# Altium project SVPX_FMC_6U_SOM.PrjPcb (part 4 of 5)

## Sheet SoM.SchDoc
size A3
Used 2 times, as channels SoM, SoM. Parts and nets are listed once, with the designators drawn on the sheet.
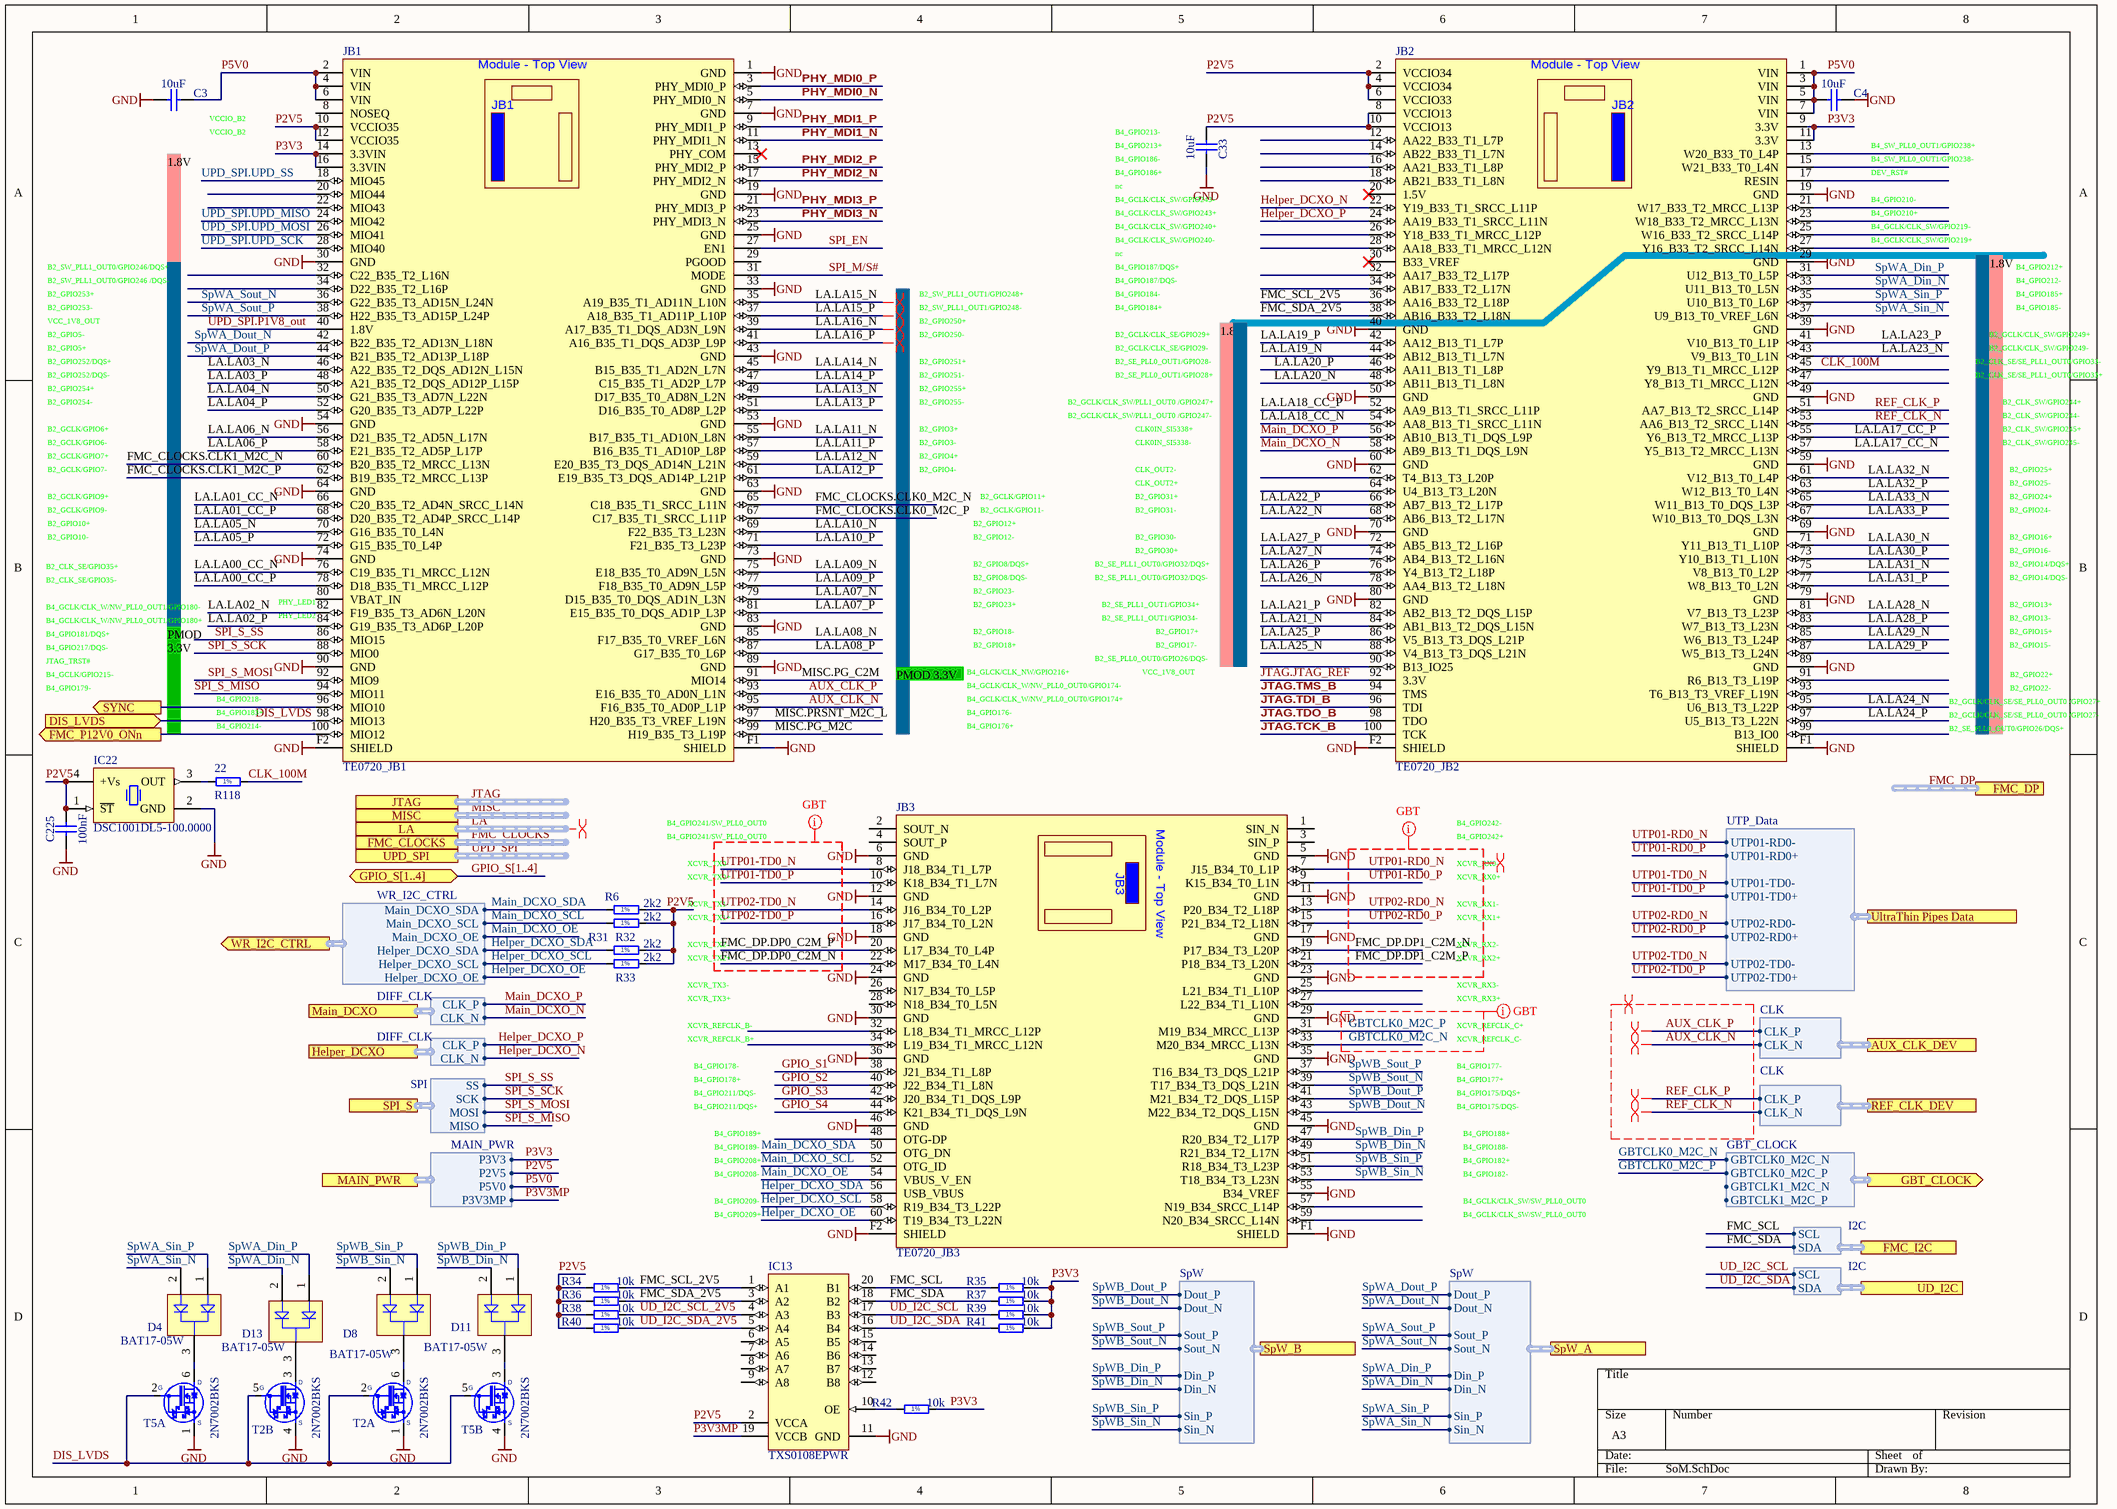
[diagram p11: SoM.SchDoc]

### Parts
C3  10uF  [CAPC2012X95N]
C4  10uF  [CAPC2012X95N]
C33  10uF  [CAPC2012X95N]
C225  100nF  [CAPC0603X33N]
D4  BAT17-05W  [INF-SOT323_N]
D8  BAT17-05W  [INF-SOT323_N]
D11  BAT17-05W  [INF-SOT323_N]
D13  BAT17-05W  [INF-SOT323_N]
IC13  TXS0108EPWR  [PW0020A_M]
IC22  DSC1001DL5-100.0000  [OSC_MICREL_2520]
JB1  TE0720_JB1  [LSHM-150-XXX-X-DV-A-X]
JB2  TE0720_JB2  [LSHM-150-XXX-X-DV-A-X]
JB3  TE0720_JB3  [LSHM-130-04.0-x-DV-A-S-K-TR]
R6  2k2  [RESC1005X40N]
R31  2k2  [RESC1005X40N]
R32  2k2  [RESC1005X40N]
R33  2k2  [RESC1005X40N]
R34  10k  [RESC1005X40N]
R35  10k  [RESC1005X40N]
R36  10k  [RESC1005X40N]
R37  10k  [RESC1005X40N]
R38  10k  [RESC1005X40N]
R39  10k  [RESC1005X40N]
R40  10k  [RESC1005X40N]
R41  10k  [RESC1005X40N]
R42  10k  [RESC1005X40N]
R118  22  [RESC1005X40N]
T2  2N7002BKS  [SOT65P210X110-6N]  (parts A,B of 2)
T5  2N7002BKS  [SOT65P210X110-6N]  (parts A,B of 2)

### Ports
AUX_CLK_DEV (harness CLK), DIS_LVDS (in), FMC_CLOCKS (harness FMC_CLOCKS), FMC_DP (harness FMC_DP), FMC_I2C (harness I2C), FMC_P12V0_ONn (out), GBT_CLOCK (out, harness GBT_CLOCK), GPIO_S[1..4] (bidir), Helper_DCXO (harness DIFF_CLK), JTAG (harness JTAG), LA (harness FMC_J1_LA), Main_DCXO (harness DIFF_CLK), MAIN_PWR (harness MAIN_PWR), MISC (harness MISC), REF_CLK_DEV (harness CLK), SPI_S (harness SPI), SpW_A (harness SpW), SpW_B (harness SpW), SYNC (out), UD_I2C (harness I2C), UltraThin Pipes Data (harness UTP_Data), UPD_SPI (harness UPD_SPI), WR_I2C_CTRL (out, harness WR_I2C_CTRL)

### Harnesses
SpW: Sout_P, Sout_N, Dout_P, Dout_N, Sin_P, Sin_N, Din_P, Din_N
UTP_Data: UTP02-RD0-, UTP02-RD0+, UTP02-TD0-, UTP02-TD0+, UTP01-RD0-, UTP01-RD0+, UTP01-TD0-, UTP01-TD0+
CLK: CLK_P, CLK_N
GBT_CLOCK: GBTCLK0_M2C_N, GBTCLK0_M2C_P, GBTCLK1_M2C_N, GBTCLK1_M2C_P
SPI: MISO, MOSI, SCK, SS
I2C: SCL, SDA
WR_I2C_CTRL: Helper_DCXO_OE, Helper_DCXO_SCL, Helper_DCXO_SDA, Main_DCXO_OE, Main_DCXO_SCL, Main_DCXO_SDA
DIFF_CLK: CLK_N, CLK_P
MAIN_PWR: P3V3, P2V5, P5V0, P3V3MP

### Nets
GND: C3.2 C4.1 C33.2 C225.1 IC13.11(GND) IC22.2(GND) JB1.1(GND) JB1.7(GND) JB1.19(GND) JB1.25(GND) JB1.30(GND) JB1.33(GND) JB1.43(GND) JB1.53(GND) JB1.54(GND) JB1.63(GND) JB1.64(GND) JB1.73(GND) JB1.74(GND) JB1.83(GND) JB1.89(GND) JB1.90(GND) JB1.F1(SHIELD) JB1.F2(SHIELD) JB2.19(GND) JB2.29(GND) JB2.39(GND) JB2.40(GND) JB2.49(GND) JB2.50(GND) JB2.59(GND) JB2.60(GND) JB2.69(GND) JB2.70(GND) JB2.79(GND) JB2.80(GND) JB2.89(GND) JB2.F1(SHIELD) JB2.F2(SHIELD) JB3.5(GND) JB3.6(GND) JB3.11(GND) JB3.12(GND) JB3.17(GND) JB3.18(GND) JB3.23(GND) JB3.24(GND) JB3.29(GND) JB3.30(GND) JB3.35(GND) JB3.36(GND) JB3.45(GND) JB3.46(GND) JB3.55(B34_VREF) JB3.F1(SHIELD) JB3.F2(SHIELD) T2.1(S) T2.4(S) T5.1(S) T5.4(S)
AUX_CLK_N: JB1.95(F16_B35_T0_AD0P_L1P) ; port AUX_CLK_DEV.CLK_N
AUX_CLK_P: JB1.93(E16_B35_T0_AD0N_L1N) ; port AUX_CLK_DEV.CLK_P
CLK_100M: JB2.45(Y9_B13_T1_MRCC_L12P) R118.2
DIS_LVDS: JB1.98(MIO13) T2.2(G) T2.5(G) T5.2(G) T5.5(G) ; port DIS_LVDS
FMC_CLOCKS.CLK0_M2C_N: JB1.65(C18_B35_T1_SRCC_L11N)
FMC_CLOCKS.CLK0_M2C_P: JB1.67(C17_B35_T1_SRCC_L11P)
FMC_CLOCKS.CLK1_M2C_N: JB1.60(B20_B35_T2_MRCC_L13N)
FMC_CLOCKS.CLK1_M2C_P: JB1.62(B19_B35_T2_MRCC_L13P)
FMC_DP.DP0_C2M_N: JB3.22(M17_B34_T0_L4N)
FMC_DP.DP0_C2M_P: JB3.20(L17_B34_T0_L4P)
FMC_DP.DP1_C2M_N: JB3.19(P17_B34_T3_L20P)
FMC_DP.DP1_C2M_P: JB3.21(P18_B34_T3_L20N)
FMC_P12V0_ONn: JB1.100(MIO12) ; port FMC_P12V0_ONn
FMC_SCL: IC13.20(B1) R35.1 ; port FMC_I2C.SCL
FMC_SCL_2V5: IC13.1(A1) JB2.36(AA16_B33_T2_L18P) R34.2
FMC_SDA: IC13.18(B2) R37.1 ; port FMC_I2C.SDA
FMC_SDA_2V5: IC13.3(A2) JB2.38(AB16_B33_T2_L18N) R36.2
GBTCLK0_M2C_N: JB3.33(M20_B34_MRCC_L13N) ; port GBT_CLOCK.GBTCLK0_M2C_N
GBTCLK0_M2C_P: JB3.31(M19_B34_MRCC_L13P) ; port GBT_CLOCK.GBTCLK0_M2C_P
GPIO_S1: JB3.38(J21_B34_T1_L8P)
GPIO_S2: JB3.40(J22_B34_T1_L8N)
GPIO_S3: JB3.42(J20_B34_T1_DQS_L9P)
GPIO_S4: JB3.44(K21_B34_T1_DQS_L9N)
Helper_DCXO_N: JB2.22(Y19_B33_T1_SRCC_L11P) ; port Helper_DCXO.CLK_N
Helper_DCXO_OE: JB3.60(T19_B34_T3_L22N) ; port WR_I2C_CTRL.Helper_DCXO_OE
Helper_DCXO_P: JB2.24(AA19_B33_T1_SRCC_L11N) ; port Helper_DCXO.CLK_P
Helper_DCXO_SCL: JB3.58(R19_B34_T3_L22P) R33.1 ; port WR_I2C_CTRL.Helper_DCXO_SCL
Helper_DCXO_SDA: JB3.56(USB_VBUS) R31.1 ; port WR_I2C_CTRL.Helper_DCXO_SDA
JTAG.JTAG_REF: JB2.92(3.3V)
JTAG.TCK_B: JB2.100(TCK)
JTAG.TDI_B: JB2.96(TDI)
JTAG.TDO_B: JB2.98(TDO)
JTAG.TMS_B: JB2.94(TMS)
LA.LA00_CC_N: JB1.76(C19_B35_T1_MRCC_L12N)
LA.LA00_CC_P: JB1.78(D18_B35_T1_MRCC_L12P)
LA.LA01_CC_N: JB1.66(C20_B35_T2_AD4N_SRCC_L14N)
LA.LA01_CC_P: JB1.68(D20_B35_T2_AD4P_SRCC_L14P)
LA.LA02_N: JB1.82(F19_B35_T3_AD6N_L20N)
LA.LA02_P: JB1.84(G19_B35_T3_AD6P_L20P)
LA.LA03_N: JB1.46(A22_B35_T2_DQS_AD12N_L15N)
LA.LA03_P: JB1.48(A21_B35_T2_DQS_AD12P_L15P)
LA.LA04_N: JB1.50(G21_B35_T3_AD7N_L22N)
LA.LA04_P: JB1.52(G20_B35_T3_AD7P_L22P)
LA.LA05_N: JB1.70(G16_B35_T0_L4N)
LA.LA05_P: JB1.72(G15_B35_T0_L4P)
LA.LA06_N: JB1.56(D21_B35_T2_AD5N_L17N)
LA.LA06_P: JB1.58(E21_B35_T2_AD5P_L17P)
LA.LA07_N: JB1.79(D15_B35_T0_DQS_AD1N_L3N)
LA.LA07_P: JB1.81(E15_B35_T0_DQS_AD1P_L3P)
LA.LA08_N: JB1.85(F17_B35_T0_VREF_L6N)
LA.LA08_P: JB1.87(G17_B35_T0_L6P)
LA.LA09_N: JB1.75(E18_B35_T0_AD9N_L5N)
LA.LA09_P: JB1.77(F18_B35_T0_AD9N_L5P)
LA.LA10_N: JB1.69(F22_B35_T3_L23N)
LA.LA10_P: JB1.71(F21_B35_T3_L23P)
LA.LA11_N: JB1.55(B17_B35_T1_AD10N_L8N)
LA.LA11_P: JB1.57(B16_B35_T1_AD10P_L8P)
LA.LA12_N: JB1.59(E20_B35_T3_DQS_AD14N_L21N)
LA.LA12_P: JB1.61(E19_B35_T3_DQS_AD14P_L21P)
LA.LA13_N: JB1.49(D17_B35_T0_AD8N_L2N)
LA.LA13_P: JB1.51(D16_B35_T0_AD8P_L2P)
LA.LA14_N: JB1.45(B15_B35_T1_AD2N_L7N)
LA.LA14_P: JB1.47(C15_B35_T1_AD2P_L7P)
LA.LA15_N: JB1.35(A19_B35_T1_AD11N_L10N)
LA.LA15_P: JB1.37(A18_B35_T1_AD11P_L10P)
LA.LA16_N: JB1.39(A17_B35_T1_DQS_AD3N_L9N)
LA.LA16_P: JB1.41(A16_B35_T1_DQS_AD3P_L9P)
LA.LA17_CC_N: JB2.57(Y5_B13_T2_MRCC_L13N)
LA.LA17_CC_P: JB2.55(Y6_B13_T2_MRCC_L13P)
LA.LA18_CC_N: JB2.54(AA8_B13_T1_SRCC_L11N)
LA.LA18_CC_P: JB2.52(AA9_B13_T1_SRCC_L11P)
LA.LA19_N: JB2.44(AB12_B13_T1_L7N)
LA.LA19_P: JB2.42(AA12_B13_T1_L7P)
LA.LA20_N: JB2.48(AB11_B13_T1_L8N)
LA.LA20_P: JB2.46(AA11_B13_T1_L8P)
LA.LA21_N: JB2.84(AB1_B13_T2_DQS_L15N)
LA.LA21_P: JB2.82(AB2_B13_T2_DQS_L15P)
LA.LA22_N: JB2.68(AB6_B13_T2_L17N)
LA.LA22_P: JB2.66(AB7_B13_T2_L17P)
LA.LA23_N: JB2.43(V9_B13_T0_L1N)
LA.LA23_P: JB2.41(V10_B13_T0_L1P)
LA.LA24_N: JB2.95(U6_B13_T3_L22P)
LA.LA24_P: JB2.97(U5_B13_T3_L22N)
LA.LA25_N: JB2.88(V4_B13_T3_DQS_L21N)
LA.LA25_P: JB2.86(V5_B13_T3_DQS_L21P)
LA.LA26_N: JB2.78(AA4_B13_T2_L18N)
LA.LA26_P: JB2.76(Y4_B13_T2_L18P)
LA.LA27_N: JB2.74(AB4_B13_T2_L16N)
LA.LA27_P: JB2.72(AB5_B13_T2_L16P)
LA.LA28_N: JB2.81(V7_B13_T3_L23P)
LA.LA28_P: JB2.83(W7_B13_T3_L23N)
LA.LA29_N: JB2.85(W6_B13_T3_L24P)
LA.LA29_P: JB2.87(W5_B13_T3_L24N)
LA.LA30_N: JB2.71(Y11_B13_T1_L10P)
LA.LA30_P: JB2.73(Y10_B13_T1_L10N)
LA.LA31_N: JB2.75(V8_B13_T0_L2P)
LA.LA31_P: JB2.77(W8_B13_T0_L2N)
LA.LA32_N: JB2.61(V12_B13_T0_L4P)
LA.LA32_P: JB2.63(W12_B13_T0_L4N)
LA.LA33_N: JB2.65(W11_B13_T0_DQS_L3P)
LA.LA33_P: JB2.67(W10_B13_T0_DQS_L3N)
Main_DCXO_N: JB2.58(AB9_B13_T1_DQS_L9N) ; port Main_DCXO.CLK_N
Main_DCXO_OE: JB3.54(VBUS_V_EN) ; port WR_I2C_CTRL.Main_DCXO_OE
Main_DCXO_P: JB2.56(AB10_B13_T1_DQS_L9P) ; port Main_DCXO.CLK_P
Main_DCXO_SCL: JB3.52(OTG_ID) R32.1 ; port WR_I2C_CTRL.Main_DCXO_SCL
Main_DCXO_SDA: JB3.50(OTG_DN) R6.1 ; port WR_I2C_CTRL.Main_DCXO_SDA
MISC.PG_C2M: JB1.91(MIO14)
MISC.PG_M2C: JB1.99(H19_B35_T3_L19P)
MISC.PRSNT_M2C_L: JB1.97(H20_B35_T3_VREF_L19N)
P2V5: C33.1 C225.2 IC13.2(VCCA) IC22.1(~{ST}) IC22.4(+Vs) JB1.10(VCCIO35) JB1.12(VCCIO35) JB2.2(VCCIO34) JB2.4(VCCIO34) JB2.6(VCCIO33) JB2.8(VCCIO13) JB2.10(VCCIO13) R6.2 R31.2 R32.2 R33.2 R34.1 R36.1 R38.1 R40.1 ; port MAIN_PWR.P2V5  [also labelled XCVR_TX1-]
P3V3: JB1.14(3.3VIN) JB1.16(3.3VIN) JB2.9(3.3V) JB2.11(3.3V) R35.2 R37.2 R39.2 R41.2 R42.2 ; port MAIN_PWR.P3V3
P3V3MP: IC13.19(VCCB) ; port MAIN_PWR.P3V3MP
P5V0: C3.1 C4.2 JB1.2(VIN) JB1.4(VIN) JB1.6(VIN) JB2.1(VIN) JB2.3(VIN) JB2.5(VIN) JB2.7(VIN) ; port MAIN_PWR.P5V0
PHY_MDI0_N: JB1.5(PHY_MDI0_N)
PHY_MDI0_P: JB1.3(PHY_MDI0_P)
PHY_MDI1_N: JB1.11(PHY_MDI1_N)
PHY_MDI1_P: JB1.9(PHY_MDI1_P)
PHY_MDI2_N: JB1.17(PHY_MDI2_N)
PHY_MDI2_P: JB1.15(PHY_MDI2_P)
PHY_MDI3_N: JB1.23(PHY_MDI3_N)
PHY_MDI3_P: JB1.21(PHY_MDI3_P)
REF_CLK_N: JB2.53(AA6_B13_T2_SRCC_L14N) ; port REF_CLK_DEV.CLK_N
REF_CLK_P: JB2.51(AA7_B13_T2_SRCC_L14P) ; port REF_CLK_DEV.CLK_P
SPI_EN: JB1.27(EN1)
SPI_M/S#: JB1.31(MODE)
SPI_S_MISO: JB1.94(MIO11) ; port SPI_S.MISO
SPI_S_MOSI: JB1.92(MIO9) ; port SPI_S.MOSI
SPI_S_SCK: JB1.88(MIO0) ; port SPI_S.SCK
SPI_S_SS: JB1.86(MIO15) ; port SPI_S.SS
SpWA_Din_N: D13.2(A2) JB2.33(U11_B13_T0_L5N) ; port SpW_A.Din_N
SpWA_Din_P: D13.1(A1) JB2.31(U12_B13_T0_L5P) ; port SpW_A.Din_P
SpWA_Dout_N: JB1.42(B22_B35_T2_AD13N_L18N) ; port SpW_A.Dout_N
SpWA_Dout_P: JB1.44(B21_B35_T2_AD13P_L18P) ; port SpW_A.Dout_P
SpWA_Sin_N: D4.2(A2) JB2.37(U9_B13_T0_VREF_L6N) ; port SpW_A.Sin_N
SpWA_Sin_P: D4.1(A1) JB2.35(U10_B13_T0_L6P) ; port SpW_A.Sin_P
SpWA_Sout_N: JB1.36(G22_B35_T3_AD15N_L24N) ; port SpW_A.Sout_N
SpWA_Sout_P: JB1.38(H22_B35_T3_AD15P_L24P) ; port SpW_A.Sout_P
SpWB_Din_N: D11.2(A2) JB3.49(R21_B34_T2_L17N) ; port SpW_B.Din_N
SpWB_Din_P: D11.1(A1) JB3.47(R20_B34_T2_L17P) ; port SpW_B.Din_P
SpWB_Dout_N: JB3.43(M22_B34_T2_DQS_L15N) ; port SpW_B.Dout_N
SpWB_Dout_P: JB3.41(M21_B34_T2_DQS_L15P) ; port SpW_B.Dout_P
SpWB_Sin_N: D8.2(A2) JB3.53(T18_B34_T3_L23N) ; port SpW_B.Sin_N
SpWB_Sin_P: D8.1(A1) JB3.51(R18_B34_T3_L23P) ; port SpW_B.Sin_P
SpWB_Sout_N: JB3.39(T17_B34_T3_DQS_L21N) ; port SpW_B.Sout_N
SpWB_Sout_P: JB3.37(T16_B34_T3_DQS_L21P) ; port SpW_B.Sout_P
SYNC: JB1.96(MIO10) ; port SYNC
UD_I2C_SCL: IC13.17(B3) R39.1 ; port UD_I2C.SCL
UD_I2C_SCL_2V5: IC13.4(A3) R38.2
UD_I2C_SDA: IC13.16(B4) R41.1 ; port UD_I2C.SDA
UD_I2C_SDA_2V5: IC13.5(A4) R40.2
UPD_SPI.P1V8_out: JB1.40(1.8V)
UPD_SPI.UPD_MISO: JB1.24(MIO42)
UPD_SPI.UPD_MOSI: JB1.26(MIO41)
UPD_SPI.UPD_SCK: JB1.28(MIO40)
UPD_SPI.UPD_SS: JB1.18(MIO45)
UTP01-RD0_N: JB3.7(J15_B34_T0_L1P) ; port UltraThin Pipes Data.UTP01-RD0-
UTP01-RD0_P: JB3.9(K15_B34_T0_L1N) ; port UltraThin Pipes Data.UTP01-RD0+
UTP01-TD0_N: JB3.8(J18_B34_T1_L7P) ; port UltraThin Pipes Data.UTP01-TD0-
UTP01-TD0_P: JB3.10(K18_B34_T1_L7N) ; port UltraThin Pipes Data.UTP01-TD0+
UTP02-RD0_N: JB3.13(P20_B34_T2_L18P) ; port UltraThin Pipes Data.UTP02-RD0-
UTP02-RD0_P: JB3.15(P21_B34_T2_L18N) ; port UltraThin Pipes Data.UTP02-RD0+
UTP02-TD0_N: JB3.14(J16_B34_T0_L2P) ; port UltraThin Pipes Data.UTP02-TD0-
UTP02-TD0_P: JB3.16(J17_B34_T0_L2N) ; port UltraThin Pipes Data.UTP02-TD0+
NetD4_3: D4.3(K) T5.6(D)
NetD8_3: D8.3(K) T2.6(D)
NetD11_3: D11.3(K) T5.3(D)
NetD13_3: D13.3(K) T2.3(D)
NetIC13_10: IC13.10(OE) R42.1
NetIC22_3: IC22.3(OUT) R118.1

Not connected (* = marked no-connect by the designer): IC13 6(A5) 7(A6) 8(A7) 9(A8) 12(B8) 13(B7) 14(B6) 15(B5); JB1 8(NOSEQ) 13(PHY_COM)* 20(MIO44) 22(MIO43) 29(PGOOD) 32(C22_B35_T2_L16N) 34(D22_B35_T2_L16P) 80(VBAT_IN); JB2 12(AA22_B33_T1_L7P) 13(W20_B33_T0_L4P) 14(AB22_B33_T1_L7N) 15(W21_B33_T0_L4N) 16(AA21_B33_T1_L8P) 17(RESIN) 18(AB21_B33_T1_L8N) 20(1.5V)* 21(W17_B33_T2_MRCC_L13P) 23(W18_B33_T2_MRCC_L13N) 25(W16_B33_T2_SRCC_L14P) 26(Y18_B33_T1_MRCC_L12P) 27(Y16_B33_T2_SRCC_L14N) 28(AA18_B33_T1_MRCC_L12N) 30(B33_VREF)* 32(AA17_B33_T2_L17P) 34(AB17_B33_T2_L17N) 47(Y8_B13_T1_MRCC_L12N) 62(T4_B13_T3_L20P) 64(U4_B13_T3_L20N) 90(B13_IO25) 91(R6_B13_T3_L19P) 93(T6_B13_T3_VREF_L19N) 99(B13_IO0); JB3 1(SIN_N) 2(SOUT_N) 3(SIN_P) 4(SOUT_P) 25(L21_B34_T1_L10P) 26(N17_B34_T0_L5P) 27(L22_B34_T1_L10N) 28(N18_B34_T0_L5N) 32(L18_B34_T1_MRCC_L12P) 34(L19_B34_T1_MRCC_L12N) 48(OTG-DP) 57(N19_B34_SRCC_L14P) 59(N20_B34_SRCC_L14N)

### Channels
SoM: designators end in A; ports DIS_LVDS=DIS_LVDS FMC_P12V0_ONn=FMC_P12V0_ONn SYNC=SYNC
SoM: designators end in B; ports DIS_LVDS=DIS_LVDS FMC_P12V0_ONn=FMC_P12V0_ONn SYNC=SYNC

### Buses and harness runs
bus GPIO_S[1..4] = port GPIO_S[1..4]
harness FMC_CLOCKS = port FMC_CLOCKS
harness FMC_DP = port FMC_DP
harness JTAG = port JTAG
harness LA = port LA
harness MISC = port MISC
harness UPD_SPI = port UPD_SPI

### Layout directives
differential pair: (no net found under the mark), AUX_CLK_N, AUX_CLK_N_SoM, AUX_CLK_P, AUX_CLK_P_SoM, FMC_DP.DP1_C2M_N, FMC_DP.DP1_C2M_P, LA.LA15_N_SoM, LA.LA15_P_SoM, LA.LA16_N_SoM, LA.LA16_P_SoM, REF_CLK_N, REF_CLK_N_SoM, REF_CLK_P, REF_CLK_P_SoM, UTP01-RD0_N, UTP01-RD0_P, UTP02-RD0_N, UTP02-RD0_P, XCVR_RX0+, XCVR_RX0-, XCVR_RX1+, XCVR_RX1-, XCVR_RX2+, XCVR_RX2-
net class GBT; rule Differential Pairs Routing [Pref Gap = 4.33mil    Min Gap  = 4.291mil    Max Gap  = 5milPref Width = 3.385mil    Min Width  = 3.385mil    Max Width  = 7.086mil]: FMC_DP.DP0_C2M_N, FMC_DP.DP0_C2M_P, FMC_DP.DP1_C2M_N, FMC_DP.DP1_C2M_P, GBTCLK0_M2C_N, GBTCLK0_M2C_P, UTP01-RD0_N, UTP01-RD0_P, UTP01-TD0_N, UTP01-TD0_P, UTP02-RD0_N, UTP02-RD0_P, UTP02-TD0_N, UTP02-TD0_P, XCVR_REFCLK_C+, XCVR_REFCLK_C-, XCVR_RX0+, XCVR_RX0-, XCVR_RX1+, XCVR_RX1-, XCVR_RX2+, XCVR_RX2-

### Notes on the sheet
- (near C3) VCCIO_B2
- (near C33) B4_GPIO213-
- (near C33) B4_GPIO213+
- (near C33) B4_GPIO186-
- B4_GPIO186+
- (near C4) B4_SW_PLL0_OUT1/GPIO238+
- B4_SW_PLL0_OUT1/GPIO238-
- DEV_RST#
- nc
- (near C33) B4_GCLK/CLK_SW/GPIO243-
- B4_GCLK/CLK_SW/GPIO243+
- B4_GCLK/CLK_SW/GPIO240+
- B4_GCLK/CLK_SW/GPIO240-
- B4_GPIO210-
- B4_GPIO210+
- B4_GCLK/CLK_SW/GPIO219-
- B4_GCLK/CLK_SW/GPIO219+
- B2_SW_PLL1_OUT0/GPIO246/DQS+
- B2_SW_PLL1_OUT0/GPIO246 /DQS-
- B2_GPIO253+
- B2_GPIO253-
- 1.8V
- B2_SW_PLL1_OUT1/GPIO248+
- B2_SW_PLL1_OUT1/GPIO248-
- B4_GPIO187/DQS+
- B4_GPIO187/DQS-
- B4_GPIO184-
- B4_GPIO184+
- B4_GPIO212+
- B4_GPIO212-
- B4_GPIO185+
- B4_GPIO185-
- VCC_1V8_OUT
- B2_GPIO5-
- B2_GPIO5+
- B2_GPIO252/DQS+
- B2_GPIO252/DQS-
- B2_GPIO250+
- B2_GPIO250-
- B2_GPIO251+
- B2_GPIO251-
- B2_GCLK/CLK_SE/GPIO29+
- B2_GCLK/CLK_SE/GPIO29-
- B2_SE_PLL0_OUT1/GPIO28-
- B2_SE_PLL0_OUT1/GPIO28+
- B2_CLK_SE/SE_PLL1_OUT0/GPIO33-
- B2_CLK_SE/SE_PLL1_OUT0/GPIO33+
- B2_GCLK/CLK_SW/GPIO249+
- B2_GCLK/CLK_SW/GPIO249-
- B2_GPIO254+
- B2_GPIO254-
- B2_GCLK/GPIO6+
- B2_GCLK/GPIO6-
- B2_GPIO255+
- B2_GPIO255-
- B2_GPIO3+
- B2_GPIO3-
- B2_GCLK/CLK_SW/PLL1_OUT0	/GPIO247+
- B2_GCLK/CLK_SW/PLL1_OUT0	/GPIO247-
- CLK0IN_SI5338+
- CLK0IN_SI5338-
- B2_CLK_SW/GPIO244+
- B2_CLK_SW/GPIO244-
- B2_CLK_SW/GPIO245+
- B2_CLK_SW/GPIO245-
- B2_GCLK/GPIO7+
- B2_GCLK/GPIO7-
- B2_GCLK/GPIO9+
- B2_GCLK/GPIO9-
- B2_GPIO4+
- B2_GPIO4-
- B2_GCLK/GPIO11+
- B2_GCLK/GPIO11-
- CLK_OUT2-
- CLK_OUT2+
- B2_GPIO31+
- B2_GPIO31-
- B2_GPIO25+
- B2_GPIO25-
- B2_GPIO24+
- B2_GPIO24-
- B2_CLK_SE/GPIO35+
- B2_CLK_SE/GPIO35-
- B2_GPIO10+
- B2_GPIO10-
- B2_GPIO12+
- B2_GPIO12-
- B2_GPIO8/DQS+
- B2_GPIO8/DQS-
- B2_SE_PLL1_OUT0/GPIO32/DQS+
- B2_SE_PLL1_OUT0/GPIO32/DQS-
- B2_GPIO30-
- B2_GPIO30+
- B2_GPIO16+
- B2_GPIO16-
- B2_GPIO14/DQS+
- B2_GPIO14/DQS-
- B4_GCLK/CLK_W/NW_PLL0_OUT1/GPIO180-
- B4_GCLK/CLK_W/NW_PLL0_OUT1/GPIO180+
- B4_GPIO181/DQS+
- B4_GPIO217/DQS-
- (near JB1) PHY_LED1
- (near JB1) PHY_LED2
- B2_GPIO23-
- B2_GPIO23+
- B2_GPIO18-
- B2_GPIO18+
- B2_SE_PLL1_OUT1/GPIO34+
- B2_SE_PLL1_OUT1/GPIO34-
- B2_GPIO17+
- B2_GPIO17-
- B2_GPIO13+
- B2_GPIO13-
- B2_GPIO15+
- B2_GPIO15-
- JTAG_TRST#
- B4_GCLK/GPIO215-
- B4_GPIO179-
- B4_GPIO218-
- B4_GPIO183+
- PMOD 3.3V
- B4_GLCK/CLK_NW/GPIO216+
- B4_GCLK/CLK_W/NW_PLL0_OUT0/GPIO174-
- B4_GCLK/CLK_W/NW_PLL0_OUT0/GPIO174+
- B4_GPIO176-
- B2_SE_PLL0_OUT0/GPIO26/DQS-
- B2_GCLK/CLK_SE/SE_PLL0_OUT0	/GPIO27+
- B2_GCLK/CLK_SE/SE_PLL0_OUT0	/GPIO27-
- B2_GPIO22+
- B2_GPIO22-
- B4_GPIO214-
- B4_GPIO176+
- B2_SE_PLL0_OUT0/GPIO26/DQS+
- B4_GCLK/CLK_SW/SW_PLL0_OUT0
- Labels drawn without touching a wire or pin: B4_GCLK/CLK_SW/SW_PLL0_OUT0, B4_GPIO175/DQS+, B4_GPIO175/DQS-, B4_GPIO177+, B4_GPIO177-, B4_GPIO178+, B4_GPIO178-, B4_GPIO182+, B4_GPIO182-, B4_GPIO188+, B4_GPIO188-, B4_GPIO189+, B4_GPIO189-, B4_GPIO208+, B4_GPIO208-, B4_GPIO209+, B4_GPIO209-, B4_GPIO211/DQS+, B4_GPIO211/DQS-, B4_GPIO241/SW_PLL0_OUT0, B4_GPIO242+, B4_GPIO242-, XCVR_REFCLK_B+, XCVR_REFCLK_B-, XCVR_REFCLK_C+, XCVR_REFCLK_C-, XCVR_RX0+, XCVR_RX0-, XCVR_RX1+, XCVR_RX1-, XCVR_RX2+, XCVR_RX2-, XCVR_RX3+, XCVR_RX3-, XCVR_TX0+, XCVR_TX0-, XCVR_TX1+, XCVR_TX2+, XCVR_TX2-, XCVR_TX3+, XCVR_TX3-
- (in symbol 25285) Module - Top View
- (in symbol 25286) Module - Top View
- (in symbol 25287) Module - Top View
- (in symbol R0402_2K2_1%_0.0625W_100PPM) 1%
- (in symbol R0402_10k_1%_0.0625W_100PPM) 1%
- (in symbol R0402_22R_1%_0.0625W_100PPM) 1%

### Library data of the parts
C3 C4 C33 = CC0805_10UF_25V_10%_X5R: Non-polarised capacitor; Part Description: SMD Multilayer Chip Ceramic Capacitor; Manufacturer: GENERIC; Manufacturer1 Part Number: GRM219R61E106KA12D; Voltage: 25V; TC: X5R; Tolerance: ±10%; Part Number: CC0805_10UF_25V_10%_X5R; Component Kind: Standard; Component Type: Standard; Pin Count: 2; Value: 10uF; Status: Preferred; Manufacturer Part Number: CC0805_10UF_25V_10%_X5R; Case: 0805; Mounted: Yes; Socket: No; SMD: Yes; Sense: No; Manufacturer1 Example: MURATA; Manufacturer1 ComponentHeight: 0.95mm; HelpURL: \\cern.ch\dfs\Applications\Altium\Datasheets\CC0805_X5R_MURATA_GRM.pdf; Author: CERN DEM JLC; CreateDate: 25/10/2012; LatestRevisionDate: 06/09/2016
C225 = CC0201_100NF_6.3V_10%_X5R: Non-polarised capacitor; Manufacturer: GENERIC; Part Description: SMD Multilayer Chip Ceramic Capacitor; Manufacturer1 Part Number: 02016D104KAT2A; Voltage: 6.3V; TC: X5R; Tolerance: ±10%; Part Number: CC0201_100NF_6.3V_10%_X5R; Component Kind: Standard; Component Type: Standard; Pin Count: 2; Value: 100nF; Status: Not Recommended; Manufacturer Part Number: CC0201_100NF_6.3V_10%_X5R; Case: 0201; Mounted: Yes; Socket: No; SMD: Yes; Sense: No; Manufacturer1 Example: AVX; Manufacturer1 ComponentHeight: 0.33mm; HelpURL: \\cern.ch\dfs\Applications\Altium\Datasheets\CC0201_X5R_AVX.pdf; Author: CERN DEM JLC; CreateDate: 03/12/2007; LatestRevisionDate: 03/12/2007
D4 D8 D11 D13 = CMP-1154-00018-1: Dual Silicon Schottky Diode, 130 mA IF Max, SOT323, Green; Manufacturer: Infineon; VF (typ): 0.34 V; CT (typ): 0.55 pF; Green: yes; Group: RF Mixer; IF (max): 130 mA; VR (max): 4 V; ComponentLink1URL: http://www.infineon.com/; Mounting Technology: Surface Mount; Halogen-free: yes; DatasheetVersion: Jun-2011; ComponentLink3Description: Package Specification; ComponentLink2URL: http://www.infineon.com/dgdl/bat17series.pdf?folderId=db3a304314dca3890114ff6812070b44&fileId=db3a304314dca389011517d785d60d4e&location=en.Products.RF.RF_Mixer___Detector_Schottky_Diodes.DATASHEET.bat17series.pdf; PartNumber: BAT17-05W; ComponentLink3URL: http://www.infineon.com/dgdl/SOT323-Package_Overview.pdf?folderId=db3a30431936bc4b0119533e1dcb3c92&fileId=db3a30431936bc4b011953495f283cb1; Configuration: Dual; PackageDescription: 3-Pin Small Outline Transistor Package, 1.25 x 2 mm Body, 0.65 mm Pitch; ComponentLink1Description: Manufacturer URL; ComponentLink2Description: Datasheet; PackageReference: SOT323
IC13 = CMP-2000-04956-1: Bidirectional Voltage-Level Translator for Open-Drain and Push-Pull Application, 8 bit, 1.2 to 3.6 V, -40 to 85 degC, 20-Pin TSSOP, Green (RoHS & no Sb/Br), Tape and Reel; Manufacturer: Texas Instruments; Logic Type: VoltageLevelTranslator; Output Current: 620µA; Propagation Delay: 4.8ns; Supply Voltage Min: 1.2V; No. of Inputs: 8; Supply Voltage Max: 5.5V; SVHC: NoSVHC(16-Jun-2014); No. of Pins: 20; Datasheet URL: https://datasheet.ciiva.com/14287/txs0108e-14287280.pdf; Operating Temperature Min: -40degC; Logic Case Style: TSSOP; Packaging: CutTape; Datasheet Version: Rev. B, 09/2008; MSL: MSL1-Unlimited; Manufacturer URL: http://www.ti.com/; Operating Temperature Max: 85degC
IC22 = OSC_DSC1001DL5-100.0000: MEMS 100MHz oscillator; Manufacturer: Micrel; Part Description: MEMS Oscillator 100MHz; Bonding: No; PressFit: No; Case: *; Component Kind: Standard; Component Type: Standard; ComponentHeigth: *; CreateDate: 2018-01-01; Device: DSC1001DL5-100.0000; Footprint: *; HelpURL: *; LatestRevisionDate: 2018-01-01; Manufacturer Part Number: DSC1001DL5-100.0000; Mounted: Yes; PackageDescription: MICREL SMD Oscillator, QFN, 4 pins, 2.5mm x 2.0mm; Part Number: DSC1001DL5-100.0000; Pin Count: 4; Sense: No; SMD: Yes; Socket: No; Value: *
JB1 = 25285: TE0720-JB1; AN: 25285; Mixed: SMT; Trenz-Stock: Yes; Trenz-Article-Number: 23838
JB2 = 25286: TE0720-JB2; AN: 25286; Mixed: SMT; Trenz-Stock: Yes; Trenz-Article-Number: 23838
JB3 = 25287: TE0720-JB3; AN: 25287; Mixed: SMT; Trenz-Stock: Yes; Trenz-Article-Number: 24903
R6 R31-R33 = R0402_2K2_1%_0.0625W_100PPM: Resistor - 1%; Part Description: General Purpose Thick Film Chip Resistor; Manufacturer: GENERIC; Manufacturer1 Part Number: 232270672202L; TC: ±100ppm/°C; PressFit: No; Part Number: R0402_2K2_1%_0.0625W_100PPM; Component Kind: Standard; Component Type: Standard; Pin Count: 2; Value: 2k2; Status: Not Recommended; Power: 0.0625W; Tolerance: ±1%; Manufacturer Part Number: R0402_2K2_1%_0.0625W_100PPM; Case: 0402; Mounted: Yes; Sense: No; Socket: No; SMD: Yes; Manufacturer1 Example: YAGEO PHYCOMP; Manufacturer1 ComponentHeight: 0.4mm; HelpURL: \\cern.ch\dfs\Applications\Altium\Datasheets\R0402_Phycomp_RC0402.pdf; Author: CERN DEM JLC; CreateDate: 03.12.2007; LatestRevisionDate: 17.10.2012
R34-R42 = R0402_10k_1%_0.0625W_100PPM: Resistor - 1%; Part Description: General Purpose Thick Film Chip Resistor; Manufacturer: GENERIC; Manufacturer1 Part Number: 232270671003L; TC: ±100ppm/°C; PressFit: No; Part Number: R0402_10K_1%_0.0625W_100PPM; Component Kind: Standard; Component Type: Standard; Pin Count: 2; Value: 10k; Status: Not Recommended; Power: 0.0625W; Tolerance: ±1%; Manufacturer Part Number: R0402_10K_1%_0.0625W_100PPM; Case: 0402; Mounted: Yes; Sense: No; Socket: No; SMD: Yes; Manufacturer1 Example: YAGEO PHYCOMP; Manufacturer1 ComponentHeight: 0.4mm; HelpURL: \\cern.ch\dfs\Applications\Altium\Datasheets\R0402_Phycomp_RC0402.pdf; Author: CERN DEM JLC; CreateDate: 03.12.2007; LatestRevisionDate: 17.10.2012
R118 = R0402_22R_1%_0.0625W_100PPM: Resistor - 1%; Part Description: General Purpose Thick Film Chip Resistor; Manufacturer: GENERIC; Manufacturer1 Part Number: 232270672209L; TC: ±100ppm/°C; PressFit: No; Part Number: R0402_22R_1%_0.0625W_100PPM; Component Kind: Standard; Component Type: Standard; Pin Count: 2; Value: 22; Status: Not Recommended; Power: 0.0625W; Tolerance: ±1%; Manufacturer Part Number: R0402_22R_1%_0.0625W_100PPM; Case: 0402; Mounted: Yes; Sense: No; Socket: No; SMD: Yes; Manufacturer1 Example: YAGEO PHYCOMP; Manufacturer1 ComponentHeight: 0.4mm; HelpURL: \\cern.ch\dfs\Applications\Altium\Datasheets\R0402_Phycomp_RC0402.pdf; Author: CERN DEM JLC; CreateDate: 03/12/2007; LatestRevisionDate: 17/10/2012
T2 T5 = 2N7002BKS: 60V, 300mA Dual N-Channel Trench MOSFET; Manufacturer: NXP SEMICONDUCTORS; Manufacturer Part Number: 2N7002BKS6; PressFit: No; Bonding: No; Part Number: 2N7002BKS; Component Kind: Standard; Component Type: Standard; Device: 2N7002BKS; PackageDescription: SOT363, SC70-6, SOT, 0.65mm Pitch, 6 pin, 1.25mm W X 2.00mm L X 1.10mm H, IPC Medium Density; Part Description: 60 V, 300 mA Dual N-Channel Trench MOSFET; Pin Count: 4; Case: SOT363; Mounted: Yes; Socket: No; SMD: Yes; Sense: No; ComponentHeight: 1.1mm; HelpURL: \\cern.ch\dfs\Applications\Altium\Datasheets\2N7002BKS.pdf; Author: CERN DEM JLC; CreateDate: 2012-11-27; LatestRevisionDate: 2012-11-27

## Sheet SLT3-PAY-1Q2T_P3.SchDoc
size A4
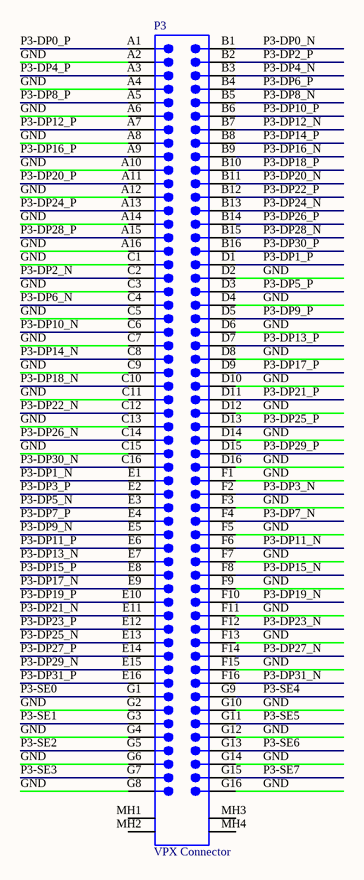
[diagram p12: SLT3-PAY-1Q2T_P3.SchDoc]

### Parts
P3  VPX Connector  [BTB1-8-4H112M]

### Nets
GND: P3.A2 P3.A4 P3.A6 P3.A8 P3.A10 P3.A12 P3.A14 P3.A16 P3.C1 P3.C3 P3.C5 P3.C7 P3.C9 P3.C11 P3.C13 P3.C15 P3.D2 P3.D4 P3.D6 P3.D8 P3.D10 P3.D12 P3.D14 P3.D16 P3.F1 P3.F3 P3.F5 P3.F7 P3.F9 P3.F11 P3.F13 P3.F15 P3.G2 P3.G4 P3.G6 P3.G8 P3.G10 P3.G12 P3.G14 P3.G16
P3-DP0_N: P3.B1
P3-DP0_P: P3.A1
P3-DP1_N: P3.E1
P3-DP1_P: P3.D1
P3-DP2_N: P3.C2
P3-DP2_P: P3.B2
P3-DP3_N: P3.F2
P3-DP3_P: P3.E2
P3-DP4_N: P3.B3
P3-DP4_P: P3.A3
P3-DP5_N: P3.E3
P3-DP5_P: P3.D3
P3-DP6_N: P3.C4
P3-DP6_P: P3.B4
P3-DP7_N: P3.F4
P3-DP7_P: P3.E4
P3-DP8_N: P3.B5
P3-DP8_P: P3.A5
P3-DP9_N: P3.E5
P3-DP9_P: P3.D5
P3-DP10_N: P3.C6
P3-DP10_P: P3.B6
P3-DP11_N: P3.F6
P3-DP11_P: P3.E6
P3-DP12_N: P3.B7
P3-DP12_P: P3.A7
P3-DP13_N: P3.E7
P3-DP13_P: P3.D7
P3-DP14_N: P3.C8
P3-DP14_P: P3.B8
P3-DP15_N: P3.F8
P3-DP15_P: P3.E8
P3-DP16_N: P3.B9
P3-DP16_P: P3.A9
P3-DP17_N: P3.E9
P3-DP17_P: P3.D9
P3-DP18_N: P3.C10
P3-DP18_P: P3.B10
P3-DP19_N: P3.F10
P3-DP19_P: P3.E10
P3-DP20_N: P3.B11
P3-DP20_P: P3.A11
P3-DP21_N: P3.E11
P3-DP21_P: P3.D11
P3-DP22_N: P3.C12
P3-DP22_P: P3.B12
P3-DP23_N: P3.F12
P3-DP23_P: P3.E12
P3-DP24_N: P3.B13
P3-DP24_P: P3.A13
P3-DP25_N: P3.E13
P3-DP25_P: P3.D13
P3-DP26_N: P3.C14
P3-DP26_P: P3.B14
P3-DP27_N: P3.F14
P3-DP27_P: P3.E14
P3-DP28_N: P3.B15
P3-DP28_P: P3.A15
P3-DP29_N: P3.E15
P3-DP29_P: P3.D15
P3-DP30_N: P3.C16
P3-DP30_P: P3.B16
P3-DP31_N: P3.F16
P3-DP31_P: P3.E16
P3-SE0: P3.G1
P3-SE1: P3.G3
P3-SE2: P3.G5
P3-SE3: P3.G7
P3-SE4: P3.G9
P3-SE5: P3.G11
P3-SE6: P3.G13
P3-SE7: P3.G15

Not connected (* = marked no-connect by the designer): P3 MH1 MH2 MH3 MH4

### Library data of the parts
P3 = 2102771-1: Ruggedized Board-to-Board Connector, Right Angle, 7-Row, Pitch 1.8mm, 112-Position; Manufacturer: TE; Bonding: No; ComponentHeigth: 14.7mm; PressFit: No; Case: *; Component Kind: Standard; Component Type: Standard; CreateDate: 2018-01-01; Device: *; Footprint: *; HelpURL: *; LatestRevisionDate: 2018-01-01; Manufacturer Part Number: 2102771-1; Mounted: Yes; PackageDescription: 2102771-1; Part Description: Ruggedized Board-to-Board Connector, Right Angle, 7-Row, Pitch 1.8mm, 112-Position; Part Number: 2102771-1; Pin Count: *; Sense: No; SMD: Yes; Socket: No; Family: VPX Connector

## Sheet SLT3-PAY-1Q2T_P4.SchDoc
size A4
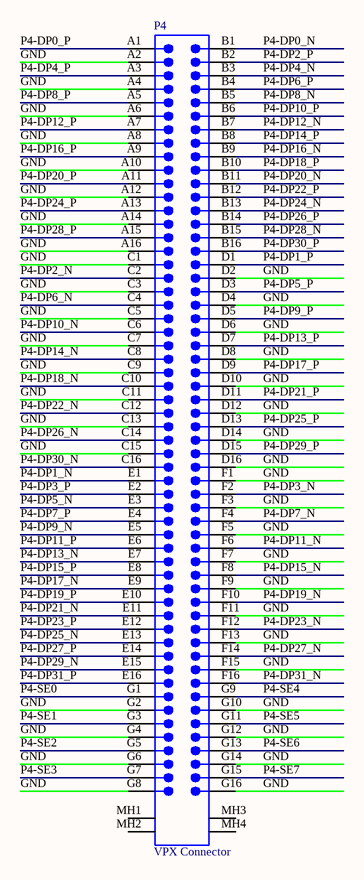
[diagram p13: SLT3-PAY-1Q2T_P4.SchDoc]

### Parts
P4  VPX Connector  [BTB1-8-4H112M]

### Nets
GND: P4.A2 P4.A4 P4.A6 P4.A8 P4.A10 P4.A12 P4.A14 P4.A16 P4.C1 P4.C3 P4.C5 P4.C7 P4.C9 P4.C11 P4.C13 P4.C15 P4.D2 P4.D4 P4.D6 P4.D8 P4.D10 P4.D12 P4.D14 P4.D16 P4.F1 P4.F3 P4.F5 P4.F7 P4.F9 P4.F11 P4.F13 P4.F15 P4.G2 P4.G4 P4.G6 P4.G8 P4.G10 P4.G12 P4.G14 P4.G16
P4-DP0_N: P4.B1
P4-DP0_P: P4.A1
P4-DP1_N: P4.E1
P4-DP1_P: P4.D1
P4-DP2_N: P4.C2
P4-DP2_P: P4.B2
P4-DP3_N: P4.F2
P4-DP3_P: P4.E2
P4-DP4_N: P4.B3
P4-DP4_P: P4.A3
P4-DP5_N: P4.E3
P4-DP5_P: P4.D3
P4-DP6_N: P4.C4
P4-DP6_P: P4.B4
P4-DP7_N: P4.F4
P4-DP7_P: P4.E4
P4-DP8_N: P4.B5
P4-DP8_P: P4.A5
P4-DP9_N: P4.E5
P4-DP9_P: P4.D5
P4-DP10_N: P4.C6
P4-DP10_P: P4.B6
P4-DP11_N: P4.F6
P4-DP11_P: P4.E6
P4-DP12_N: P4.B7
P4-DP12_P: P4.A7
P4-DP13_N: P4.E7
P4-DP13_P: P4.D7
P4-DP14_N: P4.C8
P4-DP14_P: P4.B8
P4-DP15_N: P4.F8
P4-DP15_P: P4.E8
P4-DP16_N: P4.B9
P4-DP16_P: P4.A9
P4-DP17_N: P4.E9
P4-DP17_P: P4.D9
P4-DP18_N: P4.C10
P4-DP18_P: P4.B10
P4-DP19_N: P4.F10
P4-DP19_P: P4.E10
P4-DP20_N: P4.B11
P4-DP20_P: P4.A11
P4-DP21_N: P4.E11
P4-DP21_P: P4.D11
P4-DP22_N: P4.C12
P4-DP22_P: P4.B12
P4-DP23_N: P4.F12
P4-DP23_P: P4.E12
P4-DP24_N: P4.B13
P4-DP24_P: P4.A13
P4-DP25_N: P4.E13
P4-DP25_P: P4.D13
P4-DP26_N: P4.C14
P4-DP26_P: P4.B14
P4-DP27_N: P4.F14
P4-DP27_P: P4.E14
P4-DP28_N: P4.B15
P4-DP28_P: P4.A15
P4-DP29_N: P4.E15
P4-DP29_P: P4.D15
P4-DP30_N: P4.C16
P4-DP30_P: P4.B16
P4-DP31_N: P4.F16
P4-DP31_P: P4.E16
P4-SE0: P4.G1
P4-SE1: P4.G3
P4-SE2: P4.G5
P4-SE3: P4.G7
P4-SE4: P4.G9
P4-SE5: P4.G11
P4-SE6: P4.G13
P4-SE7: P4.G15

Not connected (* = marked no-connect by the designer): P4 MH1 MH2 MH3 MH4

### Library data of the parts
P4 = 2102771-1: as P3 on sheet SLT3-PAY-1Q2T_P3; Case: *; Component Kind: Standard; Component Type: Standard; CreateDate: 2018-01-01; Device: *; Footprint: *; HelpURL: *; LatestRevisionDate: 2018-01-01; Manufacturer Part Number: 2102771-1; Mounted: Yes; PackageDescription: 2102771-1; Part Description: Ruggedized Board-to-Board Connector, Right Angle, 7-Row, Pitch 1.8mm, 112-Position; Part Number: 2102771-1; Pin Count: *; Sense: No; SMD: Yes; Socket: No; Family: VPX Connector

## Sheet SLT3-PAY-1Q2T_P6.SchDoc
size A4
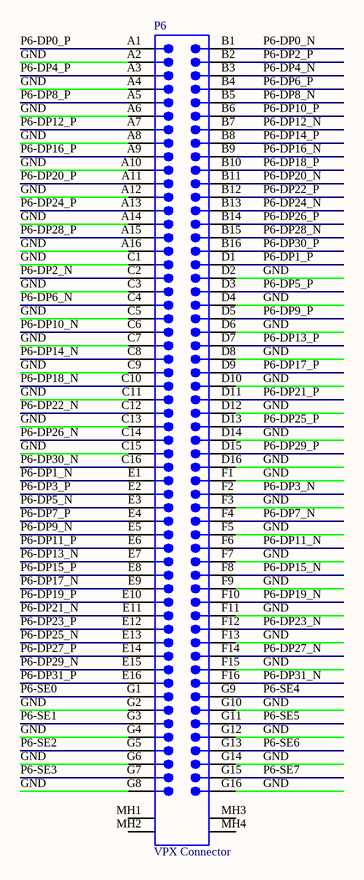
[diagram p14: SLT3-PAY-1Q2T_P6.SchDoc]

### Parts
P6  VPX Connector  [BTB1-8-4H112M]

### Nets
GND: P6.A2 P6.A4 P6.A6 P6.A8 P6.A10 P6.A12 P6.A14 P6.A16 P6.C1 P6.C3 P6.C5 P6.C7 P6.C9 P6.C11 P6.C13 P6.C15 P6.D2 P6.D4 P6.D6 P6.D8 P6.D10 P6.D12 P6.D14 P6.D16 P6.F1 P6.F3 P6.F5 P6.F7 P6.F9 P6.F11 P6.F13 P6.F15 P6.G2 P6.G4 P6.G6 P6.G8 P6.G10 P6.G12 P6.G14 P6.G16
P6-DP0_N: P6.B1
P6-DP0_P: P6.A1
P6-DP1_N: P6.E1
P6-DP1_P: P6.D1
P6-DP2_N: P6.C2
P6-DP2_P: P6.B2
P6-DP3_N: P6.F2
P6-DP3_P: P6.E2
P6-DP4_N: P6.B3
P6-DP4_P: P6.A3
P6-DP5_N: P6.E3
P6-DP5_P: P6.D3
P6-DP6_N: P6.C4
P6-DP6_P: P6.B4
P6-DP7_N: P6.F4
P6-DP7_P: P6.E4
P6-DP8_N: P6.B5
P6-DP8_P: P6.A5
P6-DP9_N: P6.E5
P6-DP9_P: P6.D5
P6-DP10_N: P6.C6
P6-DP10_P: P6.B6
P6-DP11_N: P6.F6
P6-DP11_P: P6.E6
P6-DP12_N: P6.B7
P6-DP12_P: P6.A7
P6-DP13_N: P6.E7
P6-DP13_P: P6.D7
P6-DP14_N: P6.C8
P6-DP14_P: P6.B8
P6-DP15_N: P6.F8
P6-DP15_P: P6.E8
P6-DP16_N: P6.B9
P6-DP16_P: P6.A9
P6-DP17_N: P6.E9
P6-DP17_P: P6.D9
P6-DP18_N: P6.C10
P6-DP18_P: P6.B10
P6-DP19_N: P6.F10
P6-DP19_P: P6.E10
P6-DP20_N: P6.B11
P6-DP20_P: P6.A11
P6-DP21_N: P6.E11
P6-DP21_P: P6.D11
P6-DP22_N: P6.C12
P6-DP22_P: P6.B12
P6-DP23_N: P6.F12
P6-DP23_P: P6.E12
P6-DP24_N: P6.B13
P6-DP24_P: P6.A13
P6-DP25_N: P6.E13
P6-DP25_P: P6.D13
P6-DP26_N: P6.C14
P6-DP26_P: P6.B14
P6-DP27_N: P6.F14
P6-DP27_P: P6.E14
P6-DP28_N: P6.B15
P6-DP28_P: P6.A15
P6-DP29_N: P6.E15
P6-DP29_P: P6.D15
P6-DP30_N: P6.C16
P6-DP30_P: P6.B16
P6-DP31_N: P6.F16
P6-DP31_P: P6.E16
P6-SE0: P6.G1
P6-SE1: P6.G3
P6-SE2: P6.G5
P6-SE3: P6.G7
P6-SE4: P6.G9
P6-SE5: P6.G11
P6-SE6: P6.G13
P6-SE7: P6.G15

Not connected (* = marked no-connect by the designer): P6 MH1 MH2 MH3 MH4

### Library data of the parts
P6 = 2102771-1: as P3 on sheet SLT3-PAY-1Q2T_P3; Case: *; Component Kind: Standard; Component Type: Standard; CreateDate: 2018-01-01; Device: *; Footprint: *; HelpURL: *; LatestRevisionDate: 2018-01-01; Manufacturer Part Number: 2102771-1; Mounted: Yes; PackageDescription: 2102771-1; Part Description: Ruggedized Board-to-Board Connector, Right Angle, 7-Row, Pitch 1.8mm, 112-Position; Part Number: 2102771-1; Pin Count: *; Sense: No; SMD: Yes; Socket: No; Family: VPX Connector

## Sheet SLT3-PAY-1Q2T_P5.SchDoc
size A4
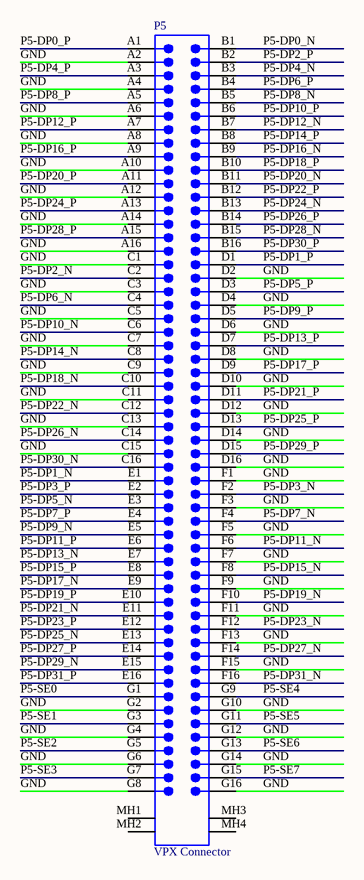
[diagram p15: SLT3-PAY-1Q2T_P5.SchDoc]

### Parts
P5  VPX Connector  [BTB1-8-4H112M]

### Nets
GND: P5.A2 P5.A4 P5.A6 P5.A8 P5.A10 P5.A12 P5.A14 P5.A16 P5.C1 P5.C3 P5.C5 P5.C7 P5.C9 P5.C11 P5.C13 P5.C15 P5.D2 P5.D4 P5.D6 P5.D8 P5.D10 P5.D12 P5.D14 P5.D16 P5.F1 P5.F3 P5.F5 P5.F7 P5.F9 P5.F11 P5.F13 P5.F15 P5.G2 P5.G4 P5.G6 P5.G8 P5.G10 P5.G12 P5.G14 P5.G16
P5-DP0_N: P5.B1
P5-DP0_P: P5.A1
P5-DP1_N: P5.E1
P5-DP1_P: P5.D1
P5-DP2_N: P5.C2
P5-DP2_P: P5.B2
P5-DP3_N: P5.F2
P5-DP3_P: P5.E2
P5-DP4_N: P5.B3
P5-DP4_P: P5.A3
P5-DP5_N: P5.E3
P5-DP5_P: P5.D3
P5-DP6_N: P5.C4
P5-DP6_P: P5.B4
P5-DP7_N: P5.F4
P5-DP7_P: P5.E4
P5-DP8_N: P5.B5
P5-DP8_P: P5.A5
P5-DP9_N: P5.E5
P5-DP9_P: P5.D5
P5-DP10_N: P5.C6
P5-DP10_P: P5.B6
P5-DP11_N: P5.F6
P5-DP11_P: P5.E6
P5-DP12_N: P5.B7
P5-DP12_P: P5.A7
P5-DP13_N: P5.E7
P5-DP13_P: P5.D7
P5-DP14_N: P5.C8
P5-DP14_P: P5.B8
P5-DP15_N: P5.F8
P5-DP15_P: P5.E8
P5-DP16_N: P5.B9
P5-DP16_P: P5.A9
P5-DP17_N: P5.E9
P5-DP17_P: P5.D9
P5-DP18_N: P5.C10
P5-DP18_P: P5.B10
P5-DP19_N: P5.F10
P5-DP19_P: P5.E10
P5-DP20_N: P5.B11
P5-DP20_P: P5.A11
P5-DP21_N: P5.E11
P5-DP21_P: P5.D11
P5-DP22_N: P5.C12
P5-DP22_P: P5.B12
P5-DP23_N: P5.F12
P5-DP23_P: P5.E12
P5-DP24_N: P5.B13
P5-DP24_P: P5.A13
P5-DP25_N: P5.E13
P5-DP25_P: P5.D13
P5-DP26_N: P5.C14
P5-DP26_P: P5.B14
P5-DP27_N: P5.F14
P5-DP27_P: P5.E14
P5-DP28_N: P5.B15
P5-DP28_P: P5.A15
P5-DP29_N: P5.E15
P5-DP29_P: P5.D15
P5-DP30_N: P5.C16
P5-DP30_P: P5.B16
P5-DP31_N: P5.F16
P5-DP31_P: P5.E16
P5-SE0: P5.G1
P5-SE1: P5.G3
P5-SE2: P5.G5
P5-SE3: P5.G7
P5-SE4: P5.G9
P5-SE5: P5.G11
P5-SE6: P5.G13
P5-SE7: P5.G15

Not connected (* = marked no-connect by the designer): P5 MH1 MH2 MH3 MH4

### Library data of the parts
P5 = 2102771-1: as P3 on sheet SLT3-PAY-1Q2T_P3; Case: *; Component Kind: Standard; Component Type: Standard; CreateDate: 2018-01-01; Device: *; Footprint: *; HelpURL: *; LatestRevisionDate: 2018-01-01; Manufacturer Part Number: 2102771-1; Mounted: Yes; PackageDescription: 2102771-1; Part Description: Ruggedized Board-to-Board Connector, Right Angle, 7-Row, Pitch 1.8mm, 112-Position; Part Number: 2102771-1; Pin Count: *; Sense: No; SMD: Yes; Socket: No; Family: VPX Connector

## Sheet FPGA_Config.SchDoc: SVPXFMC Carrier 3U
size 420 x 297 mm; CheckedBy: \; Author: G.Kasprowicz; CompanyName: ISE; DrawnBy: T.Przywozki; Organization: WUT ISE; Address1: Warsaw University of Technology; Address2: Nowowiejska 15/19 00-665 Warsaw; Revision: 1.0.; SheetNumber: 7; SheetTotal: 20; Project: SVPXFMC Carrier 3U; ModifiedBy: -; CheckedDate: -; Title2: FPGA Config; DivGrp: ISE; Designer: G. Kasprowicz
Used 2 times, as channels U_FPGA_Config, U_FPGA_Config. Parts and nets are listed once, with the designators drawn on the sheet.
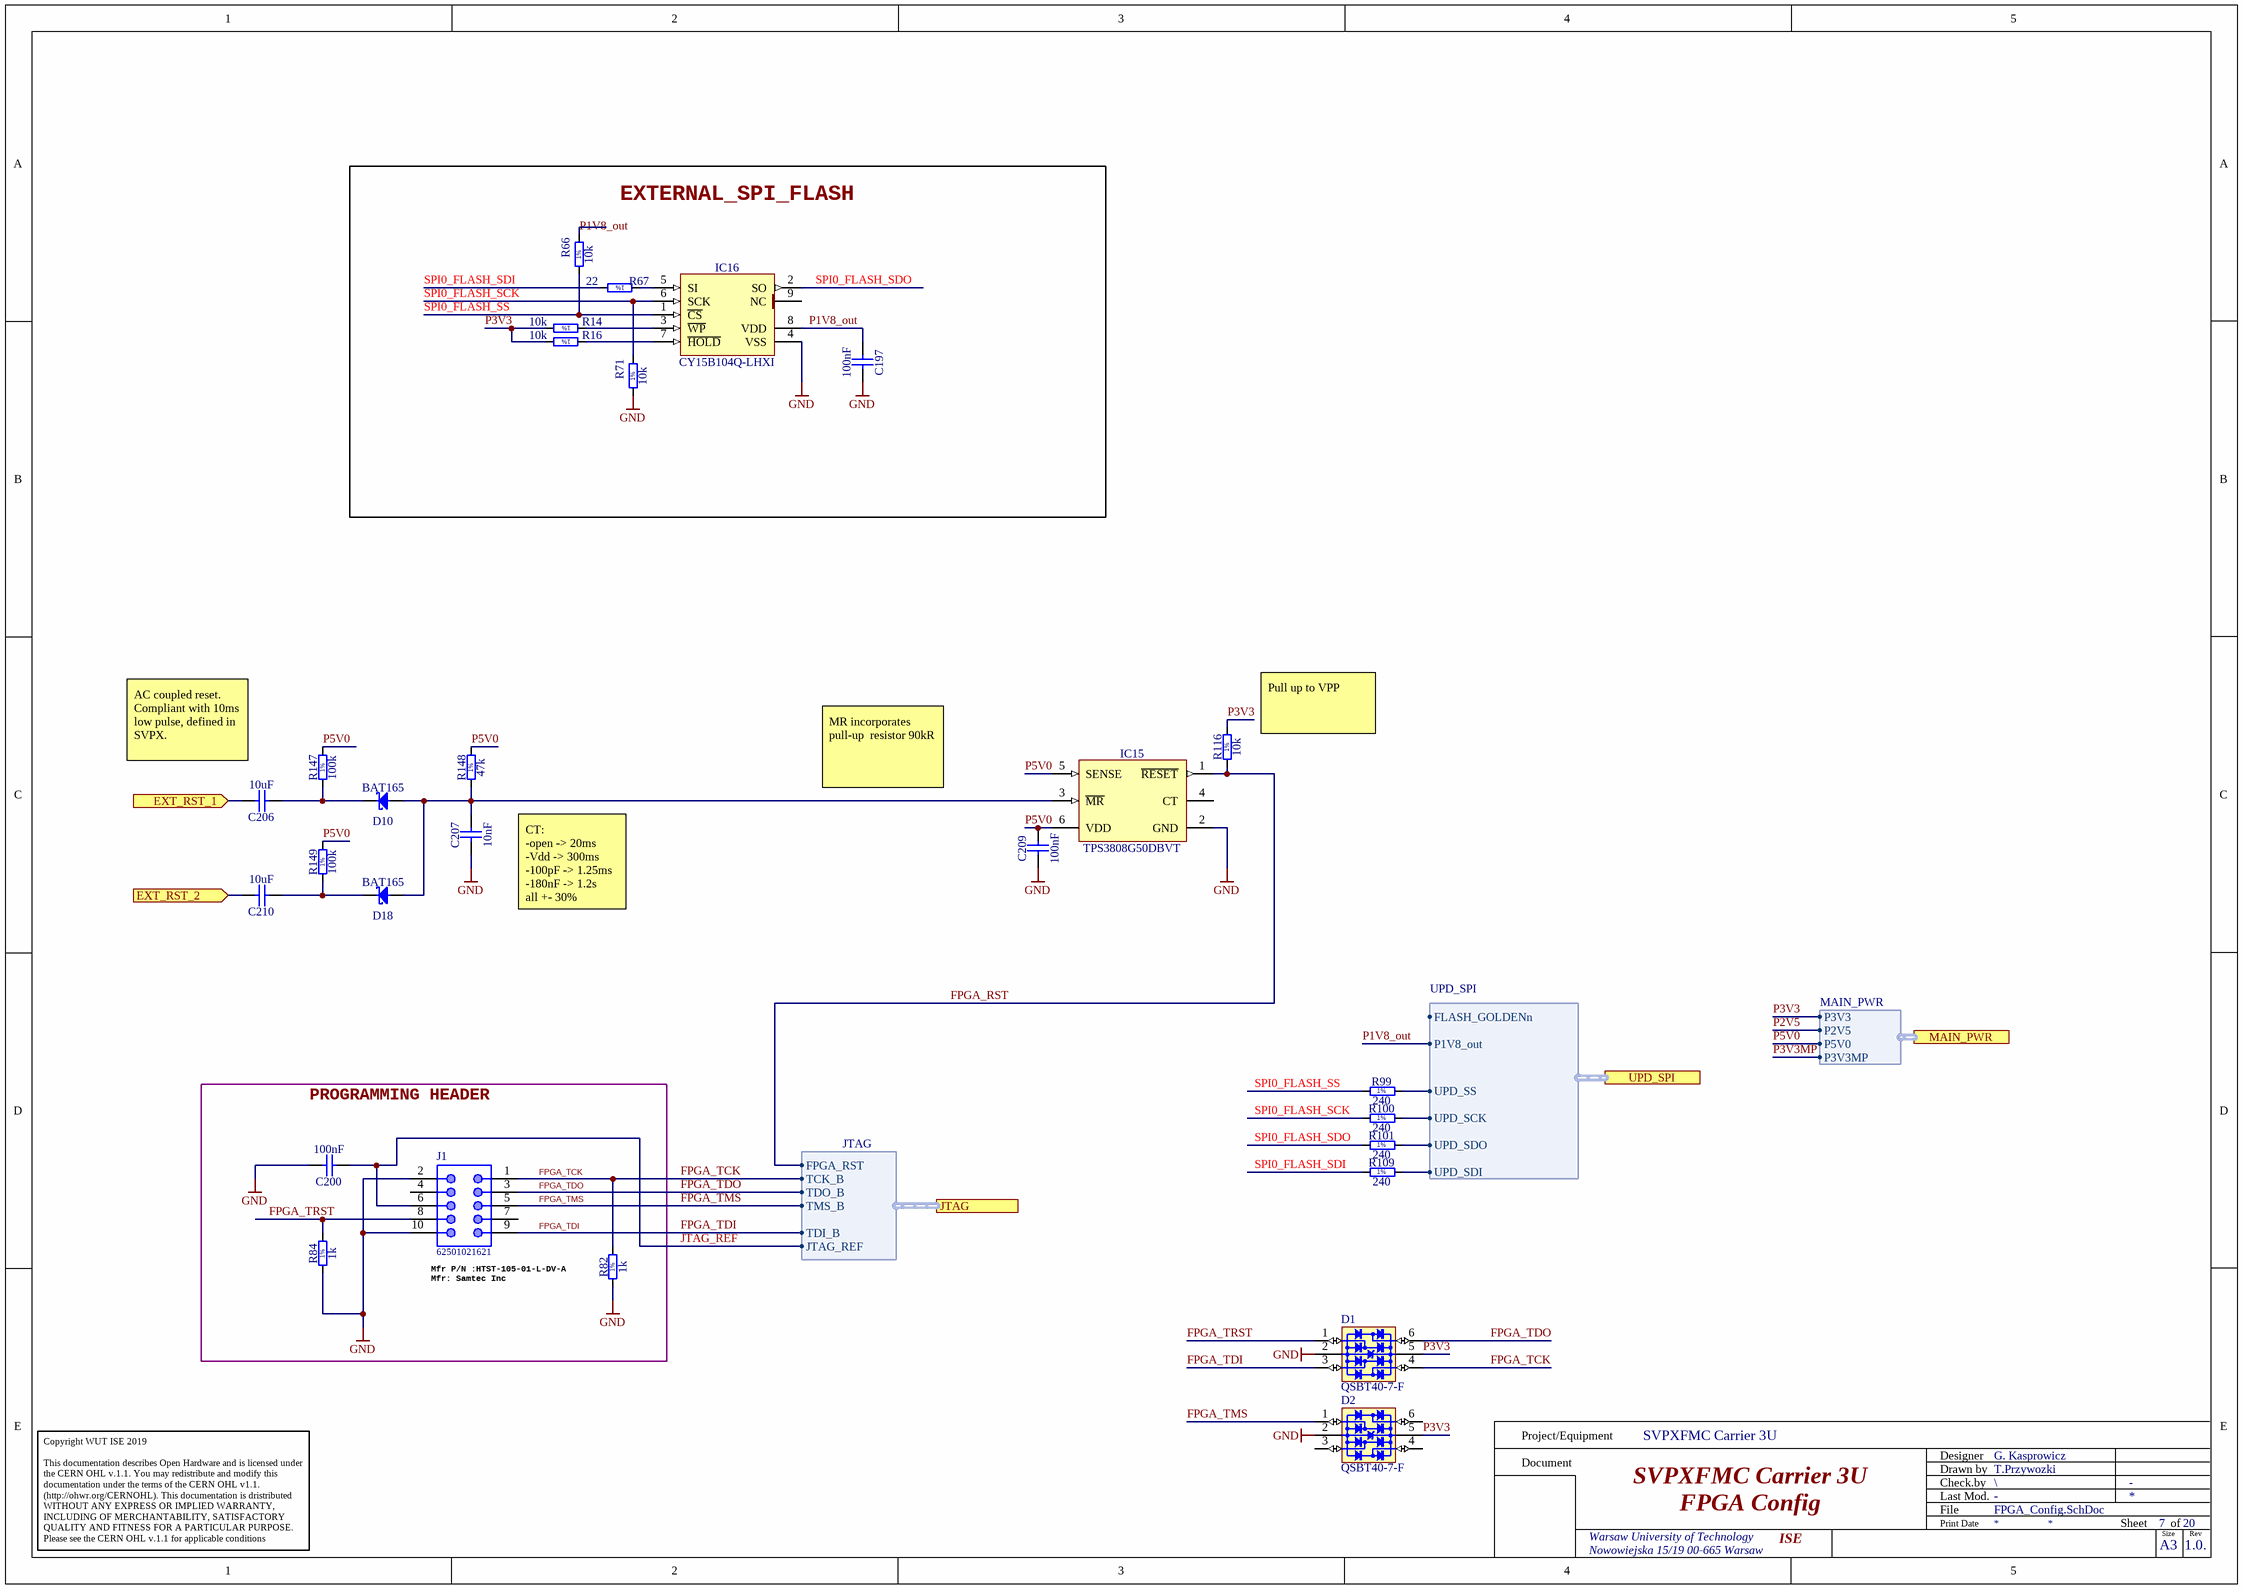
[diagram p16: FPGA_Config.SchDoc]

### Parts
C197  100nF  [CAPC0603X33N]
C200  100nF  [CAPC0603X33N]
C206  10uF  [CAPC1608X80N]
C207  10nF  [CAPC1005X55N]
C209  100nF  [CAPC1005X55N]
C210  10uF  [CAPC1608X80N]
D1  QSBT40-7-F  [SOT65P210X110-6N]
D2  QSBT40-7-F  [SOT65P210X110-6N]
D10  BAT165  [SOD2512X110N]
D18  BAT165  [SOD2512X110N]
IC15  TPS3808G50DBVT  [SOT95P280X145-6N]
IC16  CY15B104Q-LHXI  [SON127P600X500X80-9N-R240X410]
J1  62501021621  [62501021621]
R14  10k  [RESC1005X40N]
R16  10k  [RESC1005X40N]
R66  10k  [RESC1005X40N]
R67  22  [RESC1005X40N]
R71  10k  [RESC1005X40N]
R82  1k  [RESC1005X40N]
R84  1k  [RESC1005X40N]
R99  240  [RESC1005X40N]
R100  240  [RESC1005X40N]
R101  240  [RESC1005X40N]
R109  240  [RESC1005X40N]
R116  10k  [RESC1005X40N]
R147  100k  [RESC1005X40N]
R148  47k  [RESC1005X40N]
R149  100k  [RESC1005X40N]

### Blocks framed on the sheet
EXTERNAL_SPI_FLASH: C197 IC16 R14 R16 R66 R67 R71
PROGRAMMING HEADER: C200 J1 R82 R84

### Ports
EXT_RST_1 (in), EXT_RST_2 (in), JTAG (harness JTAG), MAIN_PWR (harness MAIN_PWR), UPD_SPI (harness UPD_SPI)

### Harnesses
UPD_SPI: UPD_SS, UPD_SCK, UPD_SDO, UPD_SDI, FLASH_GOLDENn, P1V8_out
MAIN_PWR: P3V3, P2V5, P5V0, P3V3MP
JTAG: JTAG_REF, TDO_B, TMS_B, TDI_B, TCK_B, FPGA_RST

### Nets
GND: C197.1 C200.2 C207.1 C209.1 D1.2(GND) D2.2(GND) IC15.2(GND) IC16.4(VSS) J1.2 J1.10 R71.1 R82.1 R84.1
EXT_RST_1: C206.2 ; port EXT_RST_1
EXT_RST_2: C210.2 ; port EXT_RST_2
FPGA_RST: IC15.1(~{RESET}) R116.1 ; port JTAG.FPGA_RST
FPGA_TCK: D1.4(I/O3) J1.1 R82.2 ; port JTAG.TCK_B
FPGA_TDI: D1.3(I/O2) J1.9 ; port JTAG.TDI_B
FPGA_TDO: D1.6(I/O4) J1.3 ; port JTAG.TDO_B
FPGA_TMS: D2.1(I/O1) J1.5 ; port JTAG.TMS_B
FPGA_TRST: D1.1(I/O1) J1.8 R84.2  [project net FPGA_TRST_7]
JTAG_REF: C200.1 J1.6 ; port JTAG.JTAG_REF
P1V8_out: C197.2 IC16.8(VDD) R66.2 ; port UPD_SPI.P1V8_out
P2V5: port MAIN_PWR.P2V5
P3V3: D1.5(VBUS) D2.5(VBUS) R14.2 R16.2 R116.2 ; port MAIN_PWR.P3V3
P3V3MP: port MAIN_PWR.P3V3MP
P5V0: C209.2 IC15.5(SENSE) IC15.6(VDD) R147.2 R148.2 R149.2 ; port MAIN_PWR.P5V0
SPI0_FLASH_SCK: IC16.6(SCK) R71.2 R100.1  [project net SPI0_FLASH_SCK_7]
SPI0_FLASH_SDI: R67.2 R109.1  [project net SPI0_FLASH_SDI_7]
SPI0_FLASH_SDO: IC16.2(SO) R101.1  [project net SPI0_FLASH_SDO_7]
SPI0_FLASH_SS: IC16.1(~{CS}) R66.1 R99.1  [project net SPI0_FLASH_SS_7]
NetC206_1: C206.1 D10.1(C) R147.1
NetC207_2: C207.2 D10.2(A) D18.2(A) IC15.3(~{MR}) R148.1
NetC210_1: C210.1 D18.1(C) R149.1
NetIC16_3: IC16.3(~{WP}) R14.1
NetIC16_5: IC16.5(SI) R67.1
NetIC16_7: IC16.7(~{HOLD}) R16.1
NetR99_2: R99.2 ; port UPD_SPI.UPD_SS
NetR100_2: R100.2 ; port UPD_SPI.UPD_SCK
NetR101_2: R101.2 ; port UPD_SPI.UPD_SDO
NetR109_2: R109.2 ; port UPD_SPI.UPD_SDI

Not connected (* = marked no-connect by the designer): D2 3(I/O2) 4(I/O3) 6(I/O4); IC15 4(CT); IC16 9(NC); J1 4 7

### Channels
U_FPGA_Config: designators end in A; ports EXT_RST_1=EXT_RST_1 EXT_RST_2=SYSRESET*
U_FPGA_Config: designators end in B; ports EXT_RST_1=EXT_RST_1 EXT_RST_2=SYSRESET*

### Notes on the sheet
- (near R116) Pull up to VPP
- (near C206) AC coupled reset. Compliant with 10ms low pulse, defined in SVPX.
- MR incorporates pull-up  resistor 90kR
- CT:
  -open -> 20ms
  -Vdd -> 300ms
  -100pF -> 1.25ms
  -180nF -> 1.2s
  all +- 30%
- (near R82) Mfr P/N :HTST-105-01-L-DV-A
  Mfr: Samtec Inc
- Project/Equipment
- Document
- Designer
- Drawn by
- Check.by
- File
- Last Mod.
- Print Date
- Sheet
- Size
- A3
- of
- Rev
- Copyright WUT ISE 2019
  This documentation describes Open Hardware and is licensed under the CERN OHL v.1.1. You may redistribute and modify this documentation under the terms of the CERN OHL v1.1.
  (http://ohwr.org/CERNOHL). This documentation is dristributed WITHOUT ANY EXPRESS OR IMPLIED WARRANTY, INCLUDING OF MERCHANTABILITY, SATISFACTORY QUALITY AND FITNESS FOR A PARTICULAR PURPOSE. Please see the CERN OHL v.1.1 for applicable conditions
- (in symbol R0402_1K_1%_0.0625W_100PPM) 1%
- (in symbol R0402_10K_1%_0.0625W_100PPM) 1%
- (in symbol R0402_22R_1%_0.0625W_100PPM) 1%
- (in symbol R0402_47K_1%_0.0625W_100PPM) 1%
- (in symbol R0402_100K_1%_0.0625W_100PPM) 1%
- (in symbol R0402_240R_1%_0.0625W_100PPM) 1%

### Library data of the parts
C197 C200 = CC0201_100NF_6.3V_10%_X5R: as C225 on sheet SoM; Part Number: CC0201_100NF_6.3V_10%_X5R; Component Kind: Standard; Component Type: Standard; Pin Count: 2; Value: 100nF; Status: Not Recommended; Manufacturer Part Number: CC0201_100NF_6.3V_10%_X5R; Case: 0201; Mounted: Yes; Socket: No; SMD: Yes; Sense: No; Manufacturer1 Example: AVX; Manufacturer1 ComponentHeight: 0.33mm; HelpURL: \\cern.ch\dfs\Applications\Altium\Datasheets\CC0201_X5R_AVX.pdf; Author: CERN DEM JLC; CreateDate: 03/12/2007; LatestRevisionDate: 03/12/2007
C206 C210 = CC0603_10UF_16V_20%_X5R: Non-polarised capacitor; Part Description: SMD Multilayer Chip Ceramic Capacitor; Manufacturer: GENERIC; Manufacturer1 Part Number: GRM188R61C106MA73D; Voltage: 16V; TC: X5R; Tolerance: ±20%; Part Number: CC0603_10UF_16V_20%_X5R; Component Kind: Standard; Component Type: Standard; Pin Count: 2; Value: 10uF; Status: None; Manufacturer Part Number: CC0603_10UF_16V_20%_X5R; Case: 0603; Mounted: Yes; Socket: No; SMD: Yes; Sense: No; Manufacturer1 Example: MURATA; Manufacturer1 ComponentHeight: 0.8mm; HelpURL: \\cern.ch\dfs\Applications\Altium\Datasheets\CC0603_X5R_MURATA_GRM.pdf; Author: CERN DEM MR; CreateDate: 2016-03-02; LatestRevisionDate: 2016-03-02
C207 = CC0402_10NF_50V_10%_X7R: Non-polarised capacitor; Part Description: SMD Multilayer Chip Ceramic Capacitor; Manufacturer: GENERIC; Manufacturer1 Part Number: GRM155R71H103KA88D; Voltage: 50V; TC: X7R; Tolerance: ±10%; Part Number: CC0402_10NF_50V_10%_X7R; Component Kind: Standard; Component Type: Standard; Pin Count: 2; Value: 10nF; Status: None; Manufacturer Part Number: CC0402_10NF_50V_10%_X7R; Case: 0402; Mounted: Yes; Socket: No; SMD: Yes; Sense: No; Manufacturer1 Example: MURATA; Manufacturer1 ComponentHeight: 0.55mm; HelpURL: \\cern.ch\dfs\Applications\Altium\Datasheets\CC0402_X7R_MURATA_GRM.pdf; Author: CERN DEM MR; CreateDate: 08.01.2016; LatestRevisionDate: 08.01.2016
C209 = CC0402_100NF_25V_10%_X7R_YUDEN_TMK105B7104KVHF: Non-polarised capacitor; Part Description: SMD Multilayer Chip Ceramic Capacitor (High Dielectric Type) for Automotive / Industrial Applications; Manufacturer: TAIYO YUDEN; Voltage: 25V; TC: X7R; Tolerance: ±10%; Part Number: CC0402_100NF_25V_10%_X7R_YUDEN_TMK105B7104KVHF; Component Kind: Standard; Component Type: Standard; Pin Count: 2; Value: 100nF; Status: Not Recommended; Manufacturer Part Number: TMK105B7104KVHF; Case: 0402; Mounted: Yes; Socket: No; SMD: Yes; Sense: No; HelpURL: \\cern.ch\dfs\Applications\Altium\Datasheets\CC0402_TAIYO-YUDEN_TMK105B7104KVHF.pdf; Author: CERN DEM JLC; CreateDate: 10.05.2017; LatestRevisionDate: 10.05.2017; ComponentHeight: 0.55mm
D1 D2 = D_TVS_QSBT40-7-F: Bonding: No; PressFit: No; Case: *; Component Kind: Standard; Component Type: Standard; ComponentHeigth: *; CreateDate: 2018-01-01; Device: QSBT40-7-F; Footprint: SOT363; HelpURL: *; LatestRevisionDate: 2018-01-01; Manufacturer: *; Manufacturer Part Number: QSBT40-7-F; Mounted: Yes; PackageDescription: *; Part Description: *; Part Number: *; Pin Count: 6; Sense: No; SMD: Yes; Socket: No; Value: *
D10 D18 = BAT165: Schottky Diode; Part Description: Medium Power AF Schottky Diode; Manufacturer: INFINEON; Voltage: 40V; Power: 750mA; PressFit: No; Bonding: No; Part Number: BAT165; Component Kind: Standard; Component Type: Standard; Device: BAT165; PackageDescription: Small Outline Diode (SOD-323), 1.70mm W X 1.25mm L X 1.10mm H body,  IPC Medium Density; Manufacturer Part Number: BAT165; Pin Count: 2; Case: SOD323; Mounted: Yes; Socket: No; SMD: Yes; Sense: No; ComponentHeight: 1.1mm; HelpURL: \\cern.ch\dfs\Applications\Altium\Datasheets\BAT165.pdf; Author: CERN DEM JLC; CreateDate: 12.11.2014; LatestRevisionDate: 12.11.2014
IC15 = TPS3808G50DBVT: Low Quiescent Current, Programmable-Delay Supervisory Circuit; Part Description: 5V, Low Quiescent Current, Programmable-Delay Supervisory Circuit; Manufacturer: TEXAS INSTRUMENTS; PressFit: No; Bonding: No; Part Number: TPS3808G50DBVT; Component Kind: Standard; Component Type: Standard; Device: TPS3808G50DBVT; PackageDescription: SOT23, 6-Leads, Body 1.6x3.0mm, Pitch 0.95mm, IPC Medium Density; Manufacturer Part Number: TPS3808G50DBVT; Pin Count: 6; Case: SOT23-6; Mounted: Yes; Socket: No; SMD: Yes; Sense: No; ComponentHeight: 1.45mm; Author: CERN DEM JLC; HelpURL: \\cern.ch\dfs\Applications\Altium\Datasheets\TPS3808G50DBVT.pdf; CreateDate: 02.03.2015; LatestRevisionDate: 02.03.2015
IC16 = CY15B104Q-LHXI: 4Mb Serial 3V F-RAM Memory; Manufacturer: CYPRESS; PressFit: No; Bonding: No; Part Number: CY15B104Q-LHXI; Component Kind: Standard; Component Type: Standard; Device: CY15B104Q-LHXI; PackageDescription: SON, 1.27mm pitch, 8 pin, 6.00mm W X 5.00mm L X 0.80mm H body (w/thermal tab  2.40 X 4.10 mm), IPC Medium Density; Part Description: 4Mb Serial 3V F-RAM Memory; Manufacturer Part Number: CY15B104Q-LHXI; Pin Count: 9; Case: SON8; Mounted: Yes; Socket: No; SMD: Yes; Sense: No; ComponentHeight: 0.8mm; HelpURL: \\cern.ch\dfs\Applications\Altium\Datasheets\CY15B104Q-LHXI.pdf; Author: CERN DEM MR; CreateDate: 14.03.2017; LatestRevisionDate: 14.03.2017
J1 = 62501021621: Male Box Header WR-BHD with long lever, THT, Vertical, pitch 2.00 mm, 10 pins; Pin Number: 10; Pitch: 2.00 mm; Working Voltage: 250 VAC; Withstanding Voltage: 500 VAC; Contact Resistance: 20 mOhm; ComponentLink1Description: Manufacturer; ComponentLink1URL: http://www.we-online.de; ComponentLink2Description: Datasheet; ComponentLink2URL: https://katalog.we-online.de/em/datasheet/6250xx21621.pdf; Part Number: 62501021621; Published Date: August 2018; Publisher: Wurth Elektronik; Operating Temperature: -40 to 125 degC; Packaging: Tray; Gender: Male; Mounting Technology: THT; Orientation: Vertical
R14 R16 R66 R71 = R0402_10K_1%_0.0625W_100PPM: Resistor - 1%; Manufacturer: GENERIC; Part Description: General Purpose Thick Film Chip Resistor; Manufacturer1 Part Number: 232270671003L; TC: ±100ppm/°C; PressFit: No; Manufacturer Part Number: R0402_10K_1%_0.0625W_100PPM; Part Number: R0402_10K_1%_0.0625W_100PPM; Tolerance: ±1%; Value: 10k; Component Kind: Standard; Component Type: Standard; Pin Count: 2; Status: Not Recommended; Power: 0.0625W; Case: 0402; Mounted: Yes; Sense: No; Socket: No; SMD: Yes; Manufacturer1 Example: YAGEO PHYCOMP; Manufacturer1 ComponentHeight: 0.4mm; HelpURL: \\cern.ch\dfs\Applications\Altium\Datasheets\R0402_Phycomp_RC0402.pdf; Author: CERN DEM JLC; CreateDate: 03/12/2007; LatestRevisionDate: 17/10/2012
R67 = R0402_22R_1%_0.0625W_100PPM: Resistor - 1%; Manufacturer: GENERIC; Part Description: General Purpose Thick Film Chip Resistor; Manufacturer1 Part Number: 232270672209L; TC: ±100ppm/°C; PressFit: No; Part Number: R0402_22R_1%_0.0625W_100PPM; Component Kind: Standard; Component Type: Standard; Pin Count: 2; Value: 22; Status: Not Recommended; Power: 0.0625W; Tolerance: ±1%; Manufacturer Part Number: R0402_22R_1%_0.0625W_100PPM; Case: 0402; Mounted: Yes; Sense: No; Socket: No; SMD: Yes; Manufacturer1 Example: YAGEO PHYCOMP; Manufacturer1 ComponentHeight: 0.4mm; HelpURL: \\cern.ch\dfs\Applications\Altium\Datasheets\R0402_Phycomp_RC0402.pdf; Author: CERN DEM JLC; CreateDate: 03/12/2007; LatestRevisionDate: 17/10/2012
R82 R84 = R0402_1K_1%_0.0625W_100PPM: Resistor - 1%; Part Description: General Purpose Thick Film Chip Resistor; Manufacturer: GENERIC; Manufacturer1 Part Number: 232270671002L; TC: ±100ppm/°C; PressFit: No; Part Number: R0402_1K_1%_0.0625W_100PPM; Component Kind: Standard; Component Type: Standard; Pin Count: 2; Value: 1k; Status: Not Recommended; Power: 0.0625W; Tolerance: ±1%; Manufacturer Part Number: R0402_1K_1%_0.0625W_100PPM; Case: 0402; Mounted: Yes; Sense: No; Socket: No; SMD: Yes; Manufacturer1 Example: YAGEO PHYCOMP; Manufacturer1 ComponentHeight: 0.4mm; HelpURL: \\cern.ch\dfs\Applications\Altium\Datasheets\R0402_Phycomp_RC0402.pdf; Author: CERN DEM JLC; CreateDate: 03/12/2007; LatestRevisionDate: 17/10/2012
R99-R101 R109 = R0402_240R_1%_0.0625W_100PPM: Resistor - 1%; Part Description: General Purpose Thick Film Chip Resistor; Manufacturer: GENERIC; Manufacturer1 Part Number: 232270672401L; TC: ±100ppm/°C; PressFit: No; Part Number: R0402_240R_1%_0.0625W_100PPM; Component Kind: Standard; Component Type: Standard; Pin Count: 2; Value: 240; Status: Not Recommended; Power: 0.0625W; Tolerance: ±1%; Manufacturer Part Number: R0402_240R_1%_0.0625W_100PPM; Case: 0402; Mounted: Yes; Sense: No; Socket: No; SMD: Yes; Manufacturer1 Example: YAGEO PHYCOMP; Manufacturer1 ComponentHeight: 0.4mm; HelpURL: \\cern.ch\dfs\Applications\Altium\Datasheets\R0402_Phycomp_RC0402.pdf; Author: CERN DEM JLC; CreateDate: 03/12/2007; LatestRevisionDate: 17/10/2012
R116 = R0402_10K_1%_0.0625W_100PPM: Resistor - 1%; Part Description: General Purpose Thick Film Chip Resistor; Manufacturer: GENERIC; Manufacturer1 Part Number: 232270671003L; TC: ±100ppm/°C; PressFit: No; Part Number: R0402_10K_1%_0.0625W_100PPM; Component Kind: Standard; Component Type: Standard; Pin Count: 2; Value: 10k; Status: Not Recommended; Power: 0.0625W; Tolerance: ±1%; Manufacturer Part Number: R0402_10K_1%_0.0625W_100PPM; Case: 0402; Mounted: Yes; Sense: No; Socket: No; SMD: Yes; Manufacturer1 Example: YAGEO PHYCOMP; Manufacturer1 ComponentHeight: 0.4mm; HelpURL: \\cern.ch\dfs\Applications\Altium\Datasheets\R0402_Phycomp_RC0402.pdf; Author: CERN DEM JLC; CreateDate: 03.12.2007; LatestRevisionDate: 17.10.2012
R147 R149 = R0402_100K_1%_0.0625W_100PPM: Resistor - 1%; Part Description: General Purpose Thick Film Chip Resistor; Manufacturer: GENERIC; Manufacturer1 Part Number: 232270671004L; TC: ±100ppm/°C; PressFit: No; Part Number: R0402_100K_1%_0.0625W_100PPM; Component Kind: Standard; Component Type: Standard; Pin Count: 2; Value: 100k; Status: Not Recommended; Power: 0.0625W; Tolerance: ±1%; Manufacturer Part Number: R0402_100K_1%_0.0625W_100PPM; Case: 0402; Mounted: Yes; Sense: No; Socket: No; SMD: Yes; Manufacturer1 Example: YAGEO PHYCOMP; Manufacturer1 ComponentHeight: 0.4mm; HelpURL: \\cern.ch\dfs\Applications\Altium\Datasheets\R0402_Phycomp_RC0402.pdf; Author: CERN DEM JLC; CreateDate: 03.12.2007; LatestRevisionDate: 17.10.2012
R148 = R0402_47K_1%_0.0625W_100PPM: Resistor - 1%; Part Description: General Purpose Thick Film Chip Resistor; Manufacturer: GENERIC; Manufacturer1 Part Number: 232270675103L; TC: ±100ppm/°C; PressFit: No; Part Number: R0402_47K_1%_0.0625W_100PPM; Component Kind: Standard; Component Type: Standard; Pin Count: 2; Value: 47k; Status: Not Recommended; Power: 0.0625W; Tolerance: ±1%; Manufacturer Part Number: R0402_47K_1%_0.0625W_100PPM; Case: 0402; Mounted: Yes; Sense: No; Socket: No; SMD: Yes; Manufacturer1 Example: YAGEO PHYCOMP; Manufacturer1 ComponentHeight: 0.4mm; HelpURL: \\cern.ch\dfs\Applications\Altium\Datasheets\R0402_Phycomp_RC0402.pdf; Author: CERN DEM JLC; CreateDate: 03.12.2007; LatestRevisionDate: 17.10.2012